# EAGLE design memory_module (EAGLE 9.6.1)
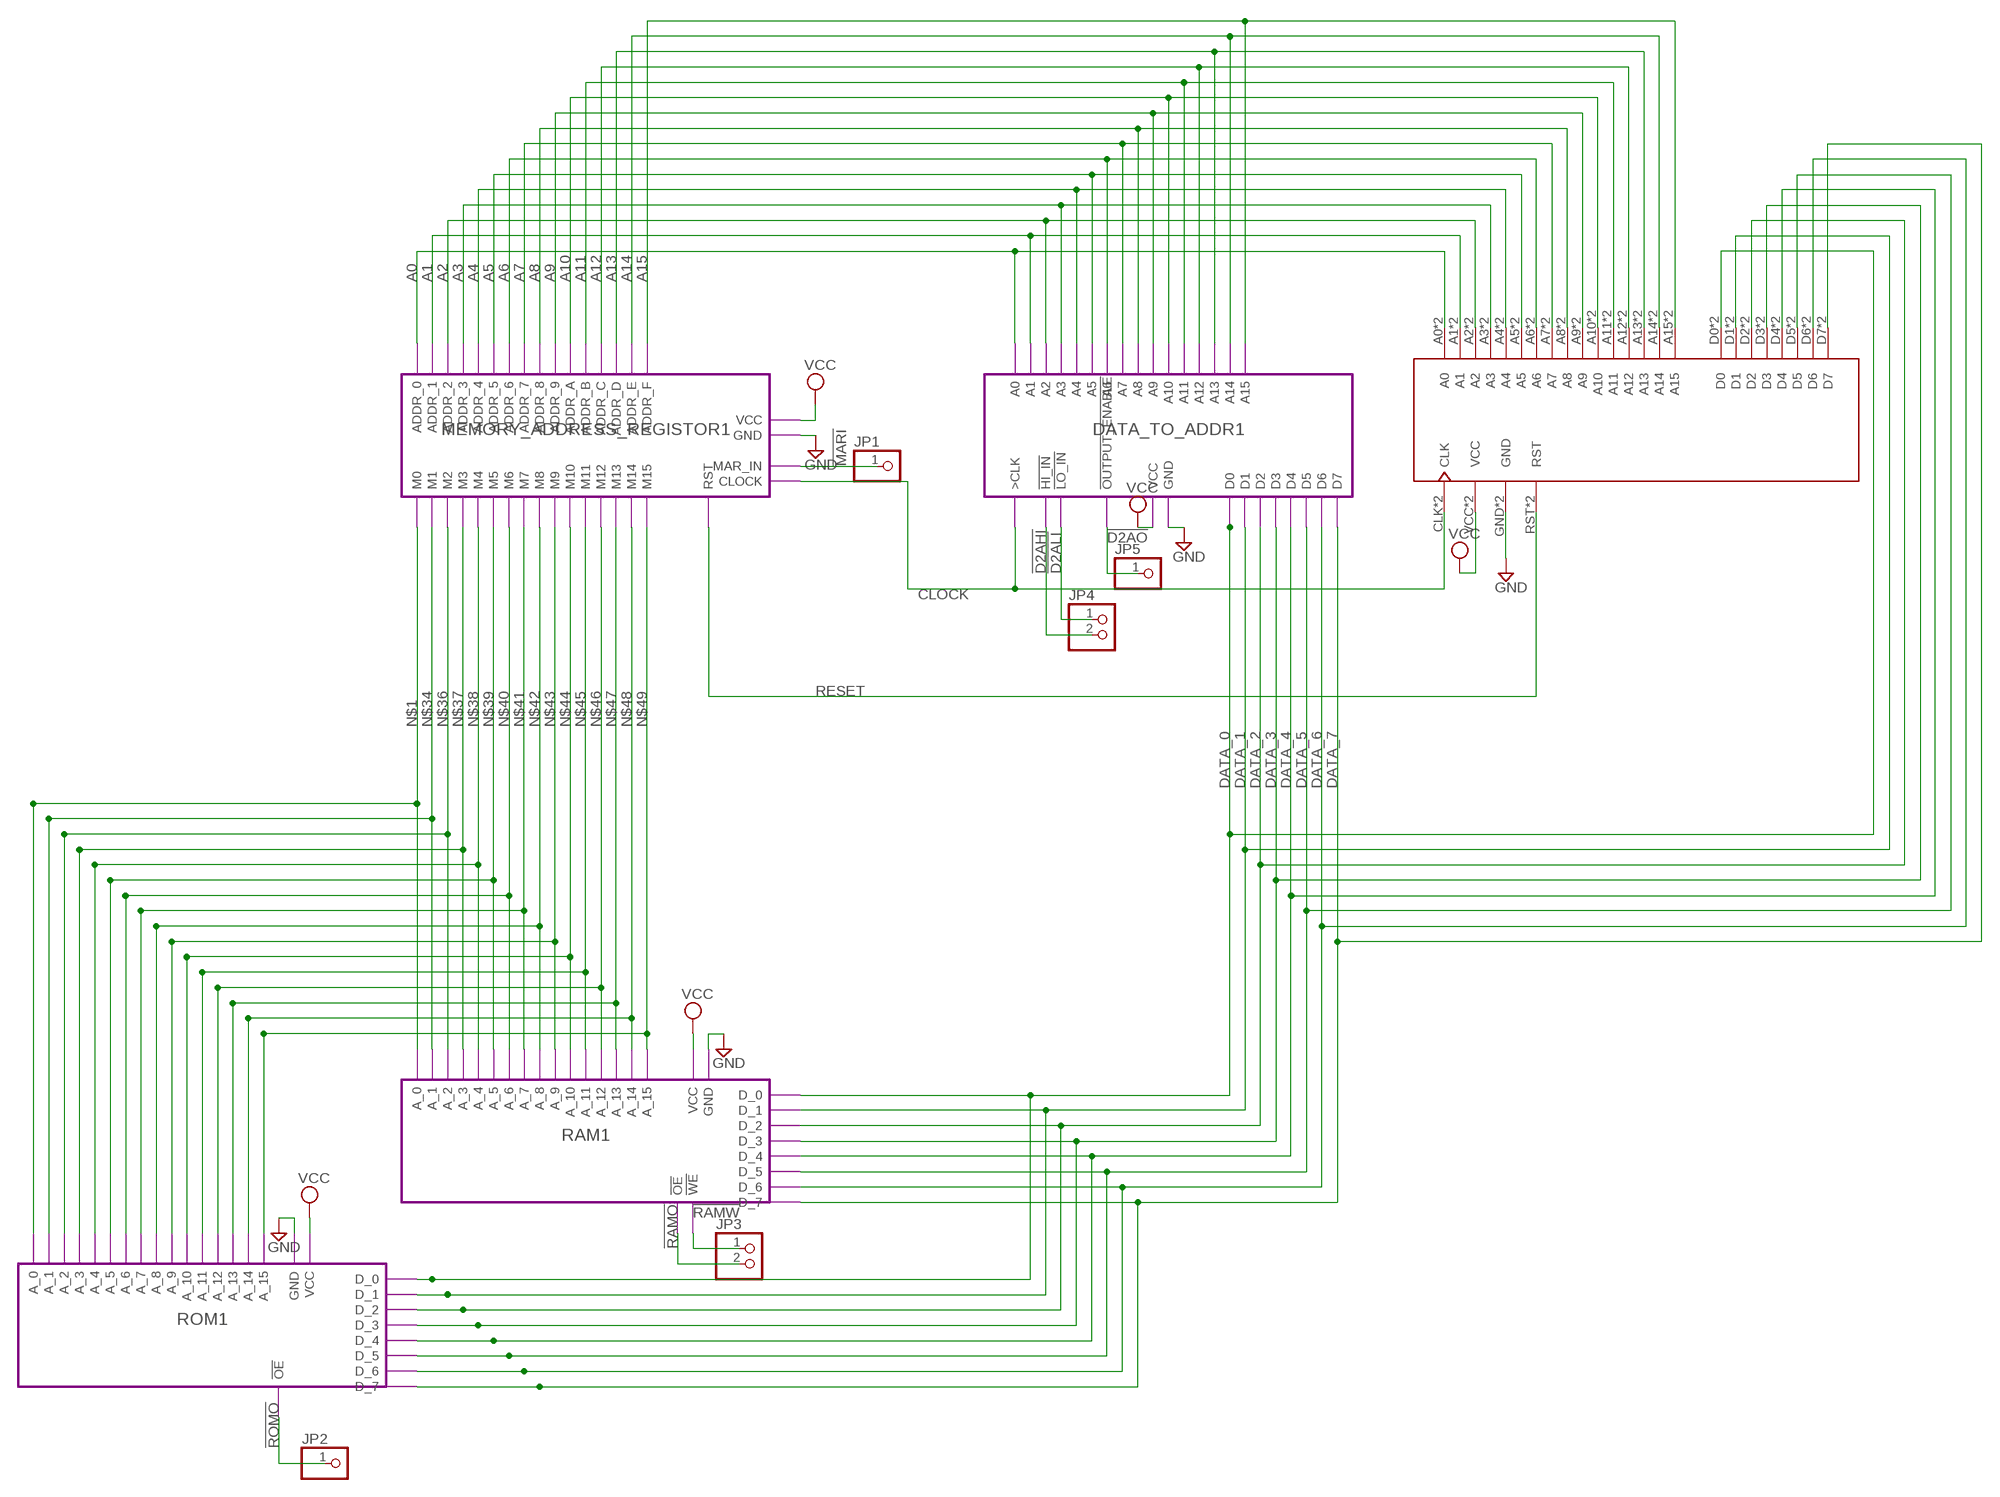
[diagram p0: schematic, sheet 1]

## Parts
JP1  PINHD-1X1  [1X01]
JP2  PINHD-1X1  [1X01]
JP3  PINHD-1X2/90  [1X02/90]
JP4  PINHD-1X2/90  [1X02/90]
JP5  PINHD-1X1  [1X01]
U$1  PORT_BOARD  [PORT_FOOTPT]

## Module instances
MEMORY_ADDRESS_REGISTOR1 = MEMORY_ADDRESS_REGISTOR
RAM1 = RAM
DATA_TO_ADDR1 = DATA_TO_ADDR
ROM1 = ROM

## Nets
!D2AHI: JP4.2 ; port DATA_TO_ADDR1.!HI_IN
!D2ALI: JP4.1 ; port DATA_TO_ADDR1.!LO_IN
!D2AO: JP5.1 ; port DATA_TO_ADDR1.!OUTPUT_ENABLE
!MARI: JP1.1 ; port MEMORY_ADDRESS_REGISTOR1.MAR_IN
!RAMO: JP3.2 ; port RAM1.!OE
!RAMW: JP3.1 ; port RAM1.!WE
!ROMO: JP2.1 ; port ROM1.!OE
A0: U$1.A0 U$1.A16(A0) ; port DATA_TO_ADDR1.A0
A1: U$1.A1 U$1.A17(A1) ; port DATA_TO_ADDR1.A1
A2: U$1.A2 U$1.A18(A2) ; port DATA_TO_ADDR1.A2
A3: U$1.A3 U$1.A19(A3) ; port DATA_TO_ADDR1.A3
A4: U$1.A4 U$1.A20(A4) ; port DATA_TO_ADDR1.A4
A5: U$1.A5 U$1.A21(A5) ; port DATA_TO_ADDR1.A5
A6: U$1.A6 U$1.A22(A6) ; port DATA_TO_ADDR1.A6
A7: U$1.A7 U$1.A23(A7) ; port DATA_TO_ADDR1.A7
A8: U$1.A8 U$1.A24(A8) ; port DATA_TO_ADDR1.A8
A9: U$1.A9 U$1.A25(A9) ; port DATA_TO_ADDR1.A9
A10: U$1.A10 U$1.A26(A10) ; port DATA_TO_ADDR1.A10
A11: U$1.A11 U$1.A27(A11) ; port DATA_TO_ADDR1.A11
A12: U$1.A12 U$1.A28(A12) ; port DATA_TO_ADDR1.A12
A13: U$1.A13 U$1.A29(A13) ; port DATA_TO_ADDR1.A13
A14: U$1.A14 U$1.A30(A14) ; port DATA_TO_ADDR1.A14
A15: U$1.A15 U$1.A31(A15) ; port DATA_TO_ADDR1.A15
CLOCK: U$1.CLK U$1.CLK1(CLK) ; port DATA_TO_ADDR1.>CLK
DATA_0: U$1.D0 U$1.D8(D0) ; port DATA_TO_ADDR1.D0
DATA_1: U$1.D1 U$1.D9(D1) ; port DATA_TO_ADDR1.D1
DATA_2: U$1.D2 U$1.D10(D2) ; port DATA_TO_ADDR1.D2
DATA_3: U$1.D3 U$1.D11(D3) ; port DATA_TO_ADDR1.D3
DATA_4: U$1.D4 U$1.D12(D4) ; port DATA_TO_ADDR1.D4
DATA_5: U$1.D5 U$1.D13(D5) ; port DATA_TO_ADDR1.D5
DATA_6: U$1.D6 U$1.D14(D6) ; port DATA_TO_ADDR1.D6
DATA_7: U$1.D7 U$1.D15(D7) ; port DATA_TO_ADDR1.D7
GND: U$1.GND U$1.GND1(GND) ; port ROM1.GND MEMORY_ADDRESS_REGISTOR1.GND DATA_TO_ADDR1.GND RAM1.GND
RESET: U$1.RST U$1.RST1(RST) ; port MEMORY_ADDRESS_REGISTOR1.RST
VCC: U$1.VCC U$1.VCC1(VCC) ; port ROM1.VCC MEMORY_ADDRESS_REGISTOR1.VCC DATA_TO_ADDR1.VCC RAM1.VCC

## Library data of the parts
JP1 JP2 JP5 = pinhead:PINHD-1X1: PIN HEADER
JP3 JP4 = pinhead:PINHD-1X2: PIN HEADER
U$1 = stack_interface:PORT_BOARD

## Module DATA_REGISTOR
Ports: DATA_0(io) DATA_1(io) DATA_2(io) DATA_3(io) DATA_4(io) DATA_5(io) DATA_6(io) DATA_7(io) !INPUT_ENABLE(in) !OUTPUT_ENABLE(in) CLOCK(in) CLR(in) UB_0(out) UB_1(out) UB_2(out) UB_3(out) UB_4(out) UB_5(out) UB_6(out) UB_7(out) VCC(pwr) GND(pwr)
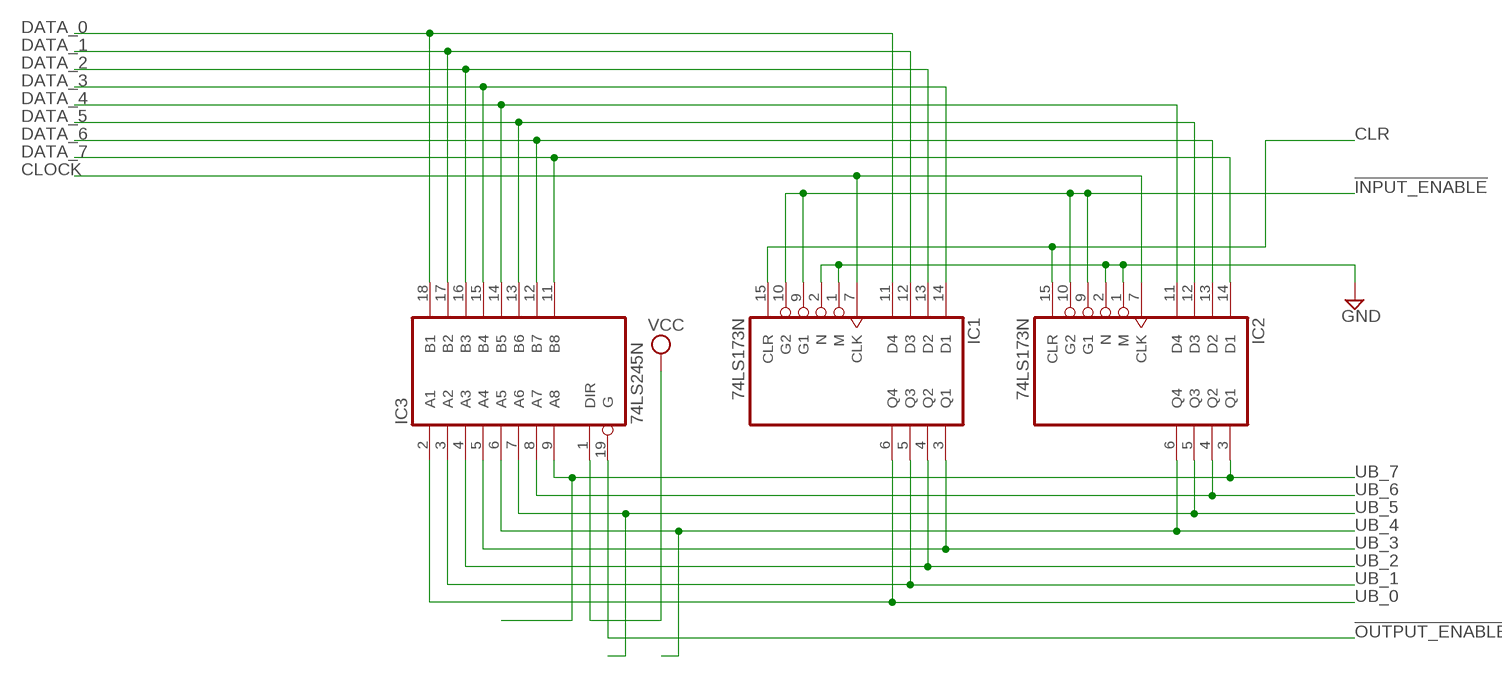
[diagram p1: schematic, module DATA_REGISTOR, sheet 1]

### Parts
IC1  74LS173N  [DIL16]
IC2  74LS173N  [DIL16]
IC3  74LS245N  [DIL20]

### Nets
!INPUT_ENABLE: IC1.9(G1) IC1.10(G2) IC2.9(G1) IC2.10(G2)
!OUTPUT_ENABLE: IC3.19(G)
CLOCK: IC1.7(CLK) IC2.7(CLK)
CLR: IC1.15(CLR) IC2.15(CLR)
DATA_0: IC1.11(D4) IC3.18(B1)
DATA_1: IC1.12(D3) IC3.17(B2)
DATA_2: IC1.13(D2) IC3.16(B3)
DATA_3: IC1.14(D1) IC3.15(B4)
DATA_4: IC2.11(D4) IC3.14(B5)
DATA_5: IC2.12(D3) IC3.13(B6)
DATA_6: IC2.13(D2) IC3.12(B7)
DATA_7: IC2.14(D1) IC3.11(B8)
GND: IC1.1(M) IC1.2(N) IC2.1(M) IC2.2(N)
UB_0: IC1.6(Q4) IC3.2(A1)
UB_1: IC1.5(Q3) IC3.3(A2)
UB_2: IC1.4(Q2) IC3.4(A3)
UB_3: IC1.3(Q1) IC3.5(A4)
UB_4: IC2.6(Q4) IC3.6(A5)
UB_5: IC2.5(Q3) IC3.7(A6)
UB_6: IC2.4(Q2) IC3.8(A7)
UB_7: IC2.3(Q1) IC3.9(A8)
VCC: IC3.1(DIR)

### Power pins joined to a net without a drawn wire
GND: IC1.8(GND) IC2.8(GND) IC3.10(GND)
VCC: IC1.16(VCC) IC2.16(VCC) IC3.20(VCC)

### Library data of the parts
IC1 IC2 = 74xx-eu:74*173: 4-bit D type REGISTER, 3-state
IC3 = 74xx-eu:74*245: Octal BUS TRANSCEIVER, 3-state

## Module MEMORY_ADDRESS_REGISTOR
Ports: ADDR_0(in) ADDR_1(in) ADDR_2(in) ADDR_3(in) ADDR_4(in) ADDR_5(in) ADDR_6(in) ADDR_7(in) ADDR_8(in) ADDR_9(in) ADDR_A(in) ADDR_B(in) ADDR_C(in) ADDR_D(in) ADDR_E(in) ADDR_F(in) CLOCK(in) MAR_IN(in) M0(out) M1(out) M2(out) M3(out) M4(out) M5(out) M6(out) M7(out) M8(out) M9(out) M10(out) M11(out) M12(out) M13(out) M14(out) M15(out) GND(pwr) VCC(pwr) RST(in)
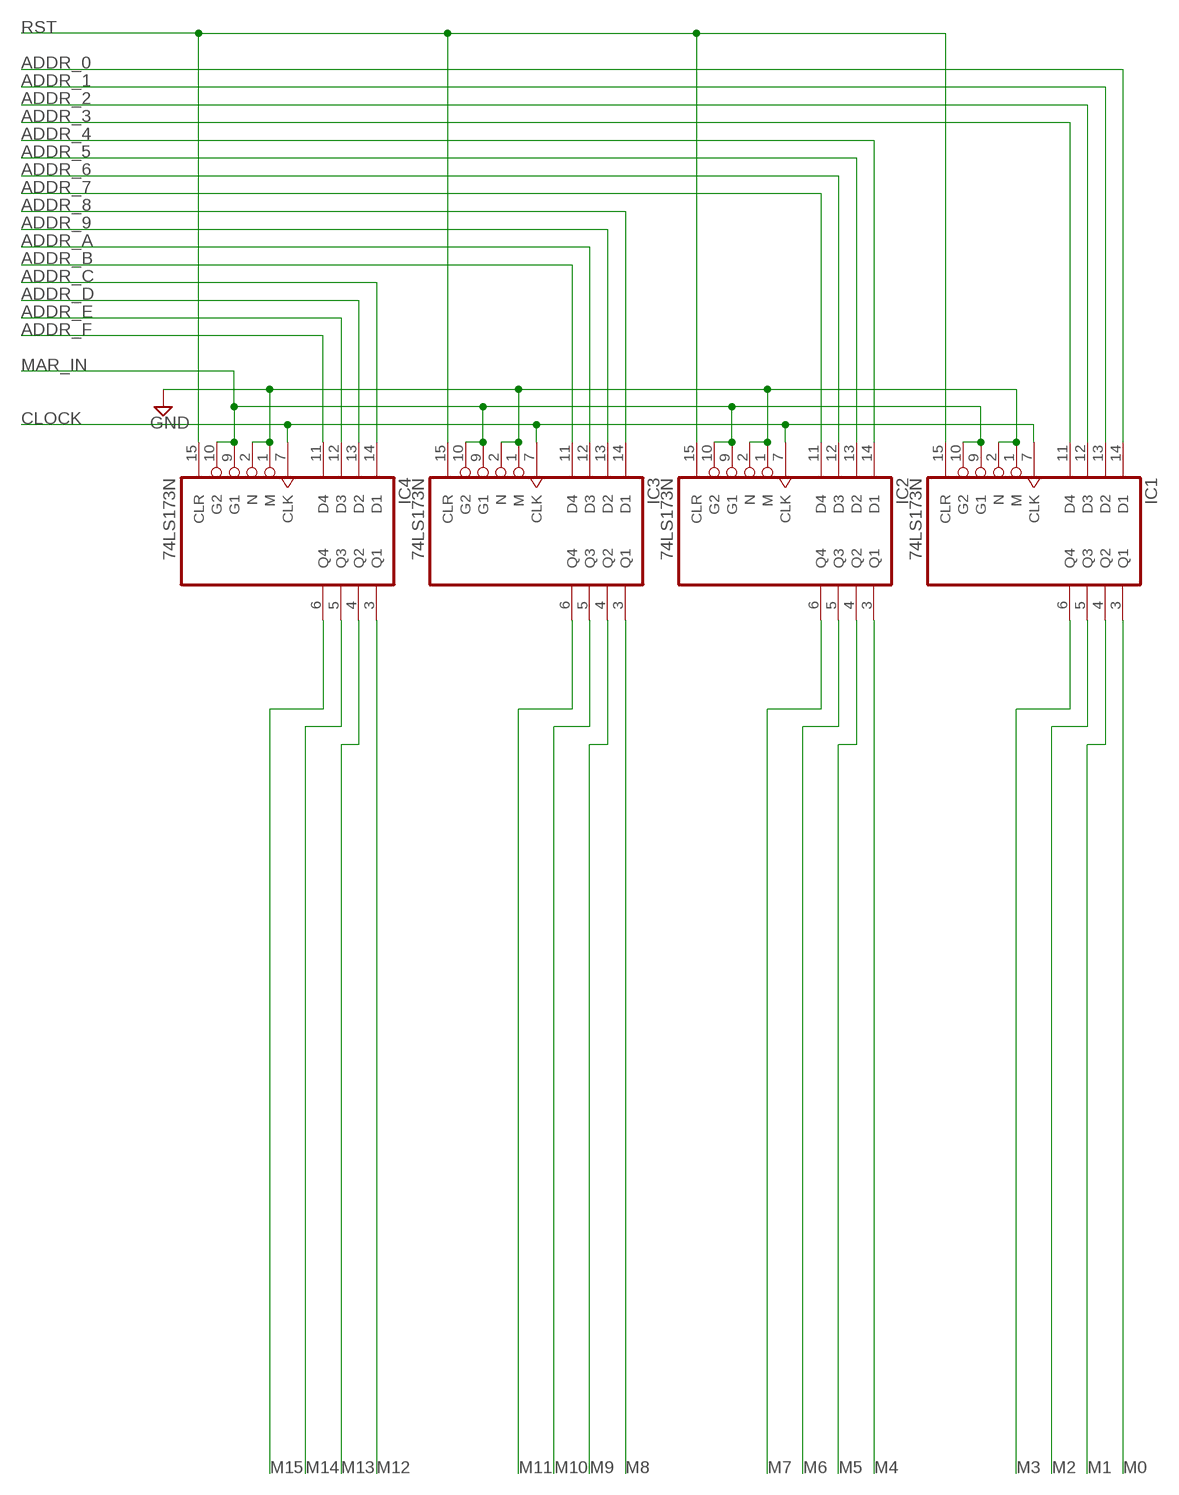
[diagram p2: schematic, module MEMORY_ADDRESS_REGISTOR, sheet 1]

### Parts
IC1  74LS173N  [DIL16]
IC2  74LS173N  [DIL16]
IC3  74LS173N  [DIL16]
IC4  74LS173N  [DIL16]

### Nets
ADDR_0: IC1.14(D1)
ADDR_1: IC1.13(D2)
ADDR_2: IC1.12(D3)
ADDR_3: IC1.11(D4)
ADDR_4: IC2.14(D1)
ADDR_5: IC2.13(D2)
ADDR_6: IC2.12(D3)
ADDR_7: IC2.11(D4)
ADDR_8: IC3.14(D1)
ADDR_9: IC3.13(D2)
ADDR_A: IC3.12(D3)
ADDR_B: IC3.11(D4)
ADDR_C: IC4.14(D1)
ADDR_D: IC4.13(D2)
ADDR_E: IC4.12(D3)
ADDR_F: IC4.11(D4)
CLOCK: IC1.7(CLK) IC2.7(CLK) IC3.7(CLK) IC4.7(CLK)
GND: IC1.1(M) IC1.2(N) IC2.1(M) IC2.2(N) IC3.1(M) IC3.2(N) IC4.1(M) IC4.2(N)
M0: IC1.3(Q1)
M1: IC1.4(Q2)
M2: IC1.5(Q3)
M3: IC1.6(Q4)
M4: IC2.3(Q1)
M5: IC2.4(Q2)
M6: IC2.5(Q3)
M7: IC2.6(Q4)
M8: IC3.3(Q1)
M9: IC3.4(Q2)
M10: IC3.5(Q3)
M11: IC3.6(Q4)
M12: IC4.3(Q1)
M13: IC4.4(Q2)
M14: IC4.5(Q3)
M15: IC4.6(Q4)
MAR_IN: IC1.9(G1) IC1.10(G2) IC2.9(G1) IC2.10(G2) IC3.9(G1) IC3.10(G2) IC4.9(G1) IC4.10(G2)
RST: IC1.15(CLR) IC2.15(CLR) IC3.15(CLR) IC4.15(CLR)

### Power pins joined to a net without a drawn wire
GND: IC1.8(GND) IC2.8(GND) IC3.8(GND) IC4.8(GND)
VCC: IC1.16(VCC) IC2.16(VCC) IC3.16(VCC) IC4.16(VCC)

### Library data of the parts
IC1-IC4 = 74xx-eu:74*173: 4-bit D type REGISTER, 3-state

## Module RAM
Ports: A_0(in) A_1(in) A_2(in) A_3(in) A_4(in) A_5(in) A_6(in) A_7(in) A_8(in) A_9(in) A_10(in) A_11(in) A_12(in) A_13(in) A_14(in) A_15(in) !OE(in) !WE(in) D_0(io) D_1(io) D_2(io) D_3(io) D_4(io) D_5(io) D_6(io) D_7(io) VCC(pwr) GND(pwr)
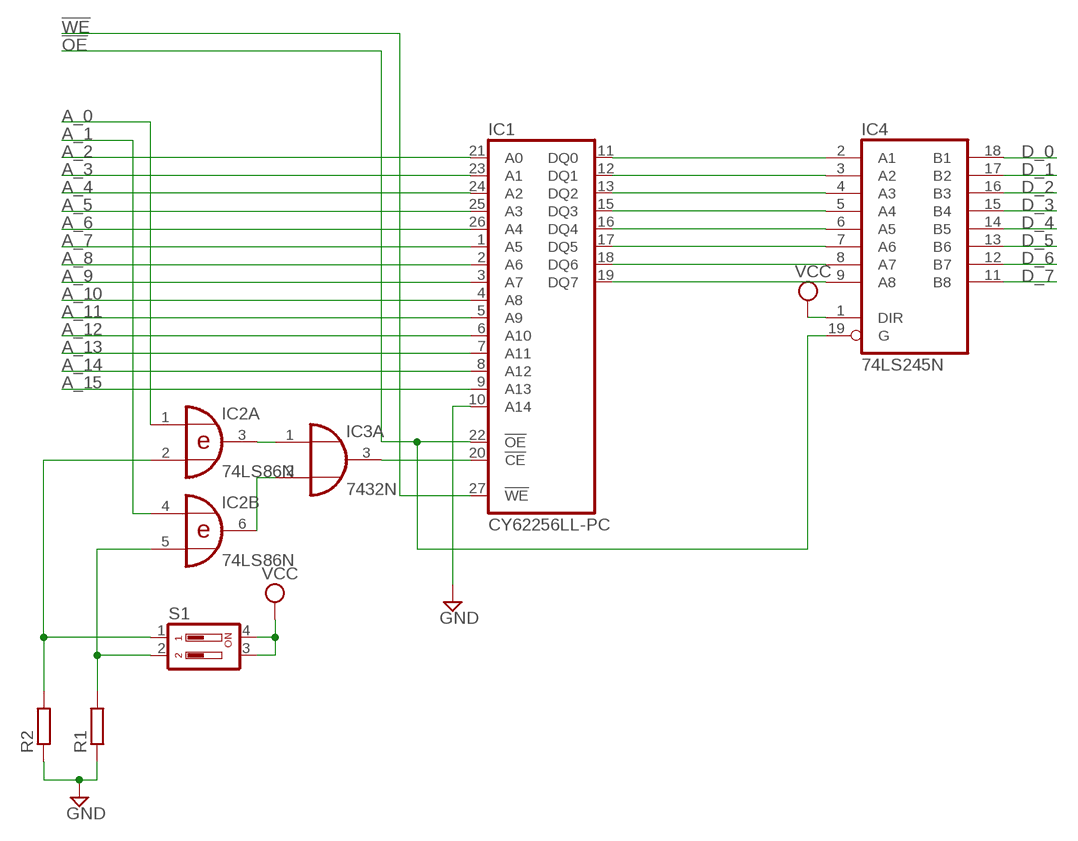
[diagram p3: schematic, module RAM, sheet 1]

### Parts
IC1  CY62256LL-PC  [DIL28-6]
IC2  74LS86N  [DIL14]
IC3  7432N  [DIL14]
IC4  74LS245N  [DIL20]
R1  R-EU_0207/7  [0207/7]
R2  R-EU_0207/7  [0207/7]
S1  DIP02YL  [DIP02YL]

### Nets
!OE: IC1.22(!OE) IC4.19(G)
!WE: IC1.27(!WE)
A_0: IC2.1(A:I0)
A_1: IC2.4(B:I0)
A_2: IC1.21(A0)
A_3: IC1.23(A1)
A_4: IC1.24(A2)
A_5: IC1.25(A3)
A_6: IC1.26(A4)
A_7: IC1.1(A5)
A_8: IC1.2(A6)
A_9: IC1.3(A7)
A_10: IC1.4(A8)
A_11: IC1.5(A9)
A_12: IC1.6(A10)
A_13: IC1.7(A11)
A_14: IC1.8(A12)
A_15: IC1.9(A13)
D_0: IC4.18(B1)
D_1: IC4.17(B2)
D_2: IC4.16(B3)
D_3: IC4.15(B4)
D_4: IC4.14(B5)
D_5: IC4.13(B6)
D_6: IC4.12(B7)
D_7: IC4.11(B8)
GND: IC1.10(A14) R1.1 R2.1
N$1: IC1.11(DQ0) IC4.2(A1)
N$2: IC1.12(DQ1) IC4.3(A2)
N$3: IC1.13(DQ2) IC4.4(A3)
N$4: IC1.15(DQ3) IC4.5(A4)
N$5: IC1.16(DQ4) IC4.6(A5)
N$6: IC1.17(DQ5) IC4.7(A6)
N$7: IC1.18(DQ6) IC4.8(A7)
N$8: IC1.19(DQ7) IC4.9(A8)
N$23: IC2.5(B:I1) R1.2 S1.2
N$24: IC2.2(A:I1) R2.2 S1.1
N$27: IC2.3(A:O) IC3.1(A:I0)
N$28: IC2.6(B:O) IC3.2(A:I1)
N$29: IC1.20(!CE) IC3.3(A:O)
VCC: IC4.1(DIR) S1.3 S1.4
Unconnected: IC2.8(C:O) IC2.9(C:I0) IC2.10(C:I1) IC2.11(D:O) IC2.12(D:I0) IC2.13(D:I1) IC3.4(B:I0) IC3.5(B:I1) IC3.6(B:O) IC3.8(C:O) IC3.9(C:I0) IC3.10(C:I1) IC3.11(D:O) IC3.12(D:I0) IC3.13(D:I1)

### Power pins joined to a net without a drawn wire
GND: IC1.14(GND) IC2.7(P:GND) IC3.7(P:GND) IC4.10(GND)
VCC: IC1.28(VCC) IC2.14(P:VCC) IC3.14(P:VCC) IC4.20(VCC)

### Library data of the parts
IC1 = memory-sram:CY62256LL-?*: 256K (32K x 8) CMOS-Static RAM Source: http://download.cypress.com.edgesuite.net/design_resources/datasheets/contents/cy62256_8.pdf
IC2 = 74xx-eu:74*86: Quad 2-input EXCLUSIVE-OR (XOR) gate
IC3 = 74xx-eu:74*32: Quad 2-input OR gate
IC4 = 74xx-eu:74*245: Octal BUS TRANSCEIVER, 3-state
R1 R2 = resistor:R-EU_: RESISTOR, European symbol
S1 = switch-dil:DIP02YL: DIL/CODE SWITCH; OC_FARNELL: unknown; OC_NEWARK: unknown

## Module DATA_TO_ADDR
Ports: D0(in) D1(in) D2(in) D3(in) D4(in) D5(in) D6(in) D7(in) >CLK(in) !HI_IN(in) !LO_IN(in) !OUTPUT_ENABLE(in) VCC(pwr) GND(pwr) A0(out) A1(out) A2(out) A3(out) A4(out) A5(out) A6(out) A7(out) A8(out) A9(out) A10(out) A11(out) A12(out) A13(out) A14(out) A15(out)
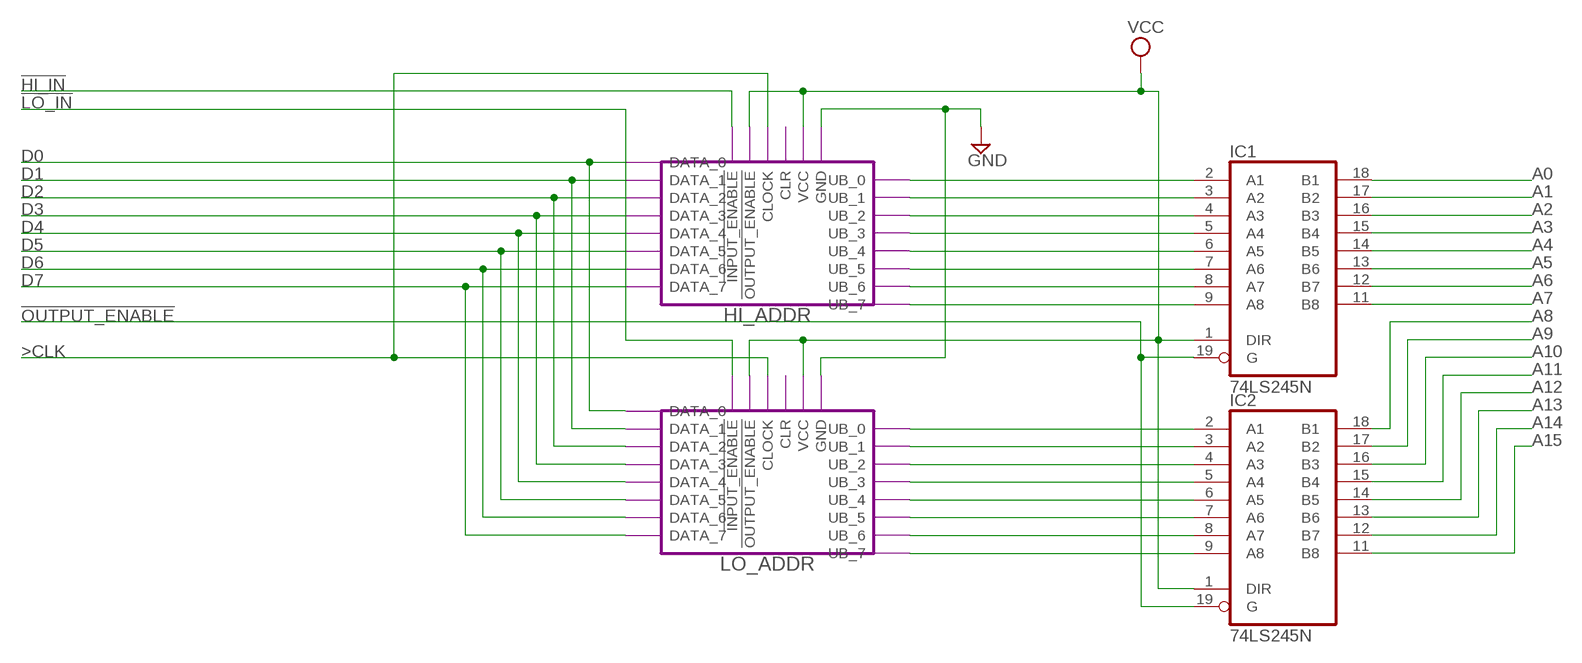
[diagram p4: schematic, module DATA_TO_ADDR, sheet 1]

### Parts
IC1  74LS245N  [DIL20]
IC2  74LS245N  [DIL20]

### Module instances
HI_ADDR = DATA_REGISTOR
LO_ADDR = DATA_REGISTOR

### Nets
!HI_IN: port HI_ADDR.!INPUT_ENABLE
!LO_IN: port LO_ADDR.!INPUT_ENABLE
!OUTPUT_ENABLE: IC1.19(G) IC2.19(G)
>CLK: port LO_ADDR.CLOCK HI_ADDR.CLOCK
A0: IC1.18(B1)
A1: IC1.17(B2)
A2: IC1.16(B3)
A3: IC1.15(B4)
A4: IC1.14(B5)
A5: IC1.13(B6)
A6: IC1.12(B7)
A7: IC1.11(B8)
A8: IC2.18(B1)
A9: IC2.17(B2)
A10: IC2.16(B3)
A11: IC2.15(B4)
A12: IC2.14(B5)
A13: IC2.13(B6)
A14: IC2.12(B7)
A15: IC2.11(B8)
D0: port HI_ADDR.DATA_0 LO_ADDR.DATA_0
D1: port HI_ADDR.DATA_1 LO_ADDR.DATA_1
D2: port HI_ADDR.DATA_2 LO_ADDR.DATA_2
D3: port HI_ADDR.DATA_3 LO_ADDR.DATA_3
D4: port HI_ADDR.DATA_4 LO_ADDR.DATA_4
D5: port HI_ADDR.DATA_5 LO_ADDR.DATA_5
D6: port HI_ADDR.DATA_6 LO_ADDR.DATA_6
D7: port HI_ADDR.DATA_7 LO_ADDR.DATA_7
GND: port LO_ADDR.GND HI_ADDR.GND
N$16: IC1.2(A1) ; port HI_ADDR.UB_0
N$17: IC1.3(A2) ; port HI_ADDR.UB_1
N$18: IC1.4(A3) ; port HI_ADDR.UB_2
N$19: IC1.5(A4) ; port HI_ADDR.UB_3
N$20: IC1.6(A5) ; port HI_ADDR.UB_4
N$21: IC1.7(A6) ; port HI_ADDR.UB_5
N$22: IC1.8(A7) ; port HI_ADDR.UB_6
N$23: IC1.9(A8) ; port HI_ADDR.UB_7
N$24: IC2.2(A1) ; port LO_ADDR.UB_0
N$25: IC2.3(A2) ; port LO_ADDR.UB_1
N$26: IC2.4(A3) ; port LO_ADDR.UB_2
N$27: IC2.5(A4) ; port LO_ADDR.UB_3
N$28: IC2.6(A5) ; port LO_ADDR.UB_4
N$29: IC2.7(A6) ; port LO_ADDR.UB_5
N$30: IC2.8(A7) ; port LO_ADDR.UB_6
N$31: IC2.9(A8) ; port LO_ADDR.UB_7
VCC: IC1.1(DIR) IC2.1(DIR) ; port HI_ADDR.VCC HI_ADDR.!OUTPUT_ENABLE LO_ADDR.!OUTPUT_ENABLE LO_ADDR.VCC

### Power pins joined to a net without a drawn wire
GND: IC1.10(GND) IC2.10(GND)
VCC: IC1.20(VCC) IC2.20(VCC)

### Library data of the parts
IC1 IC2 = 74xx-eu:74*245: Octal BUS TRANSCEIVER, 3-state

## Module ROM
Ports: A_0(in) A_1(in) A_2(in) A_3(in) A_4(in) A_5(in) A_6(in) A_7(in) A_8(in) A_9(in) A_10(in) A_11(in) A_12(in) A_13(in) A_14(in) A_15(in) !OE(in) D_0(out) D_1(out) D_2(out) D_4(out) D_3(out) D_5(out) D_6(out) D_7(out) GND(pwr) VCC(pwr)
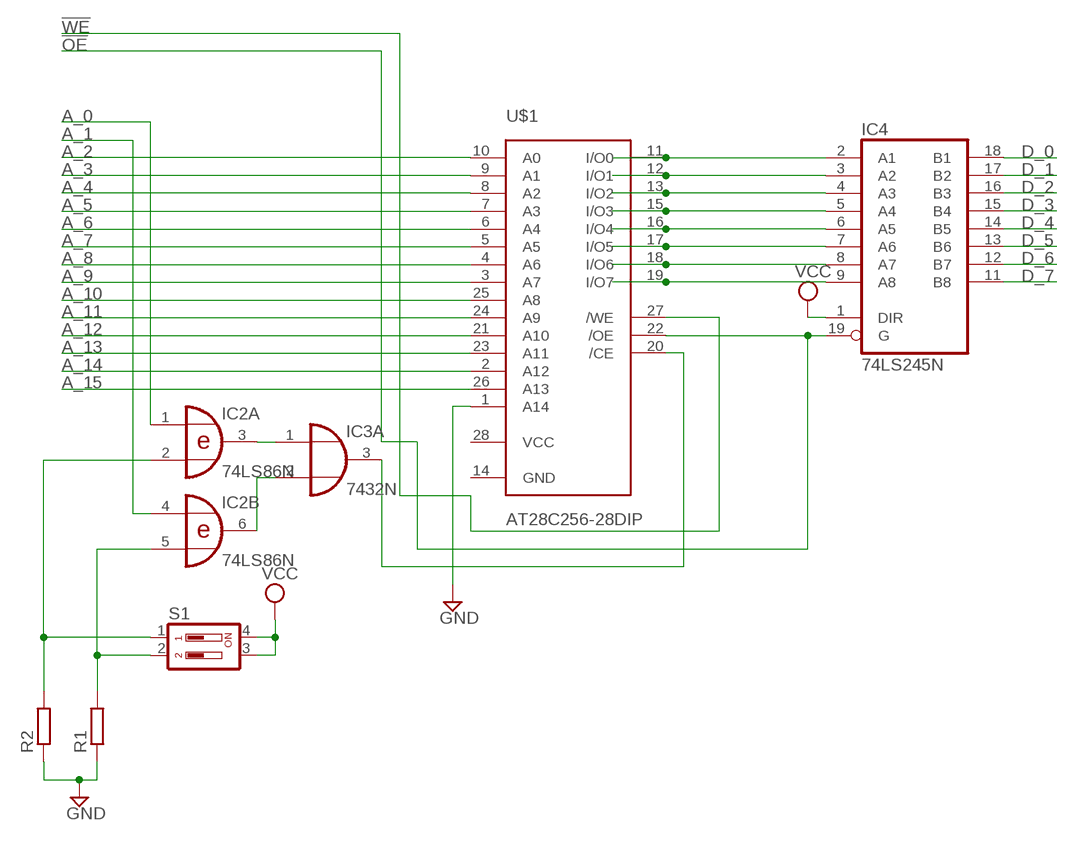
[diagram p5: schematic, module ROM, sheet 1]

### Parts
IC2  74LS86N  [DIL14]
IC3  7432N  [DIL14]
IC4  74LS245N  [DIL20]
R1  R-EU_0207/7  [0207/7]
R2  R-EU_0207/7  [0207/7]
S1  DIP02YL  [DIP02YL]
U$1  AT28C256-28DIP  [DIL28-6]

### Nets
!OE: IC4.19(G) U$1.22(/OE)
!WE: U$1.27(/WE)
A_0: IC2.1(A:I0)
A_1: IC2.4(B:I0)
A_2: U$1.10(A0)
A_3: U$1.9(A1)
A_4: U$1.8(A2)
A_5: U$1.7(A3)
A_6: U$1.6(A4)
A_7: U$1.5(A5)
A_8: U$1.4(A6)
A_9: U$1.3(A7)
A_10: U$1.25(A8)
A_11: U$1.24(A9)
A_12: U$1.21(A10)
A_13: U$1.23(A11)
A_14: U$1.2(A12)
A_15: U$1.26(A13)
D_0: IC4.18(B1)
D_1: IC4.17(B2)
D_2: IC4.16(B3)
D_3: IC4.15(B4)
D_4: IC4.14(B5)
D_5: IC4.13(B6)
D_6: IC4.12(B7)
D_7: IC4.11(B8)
GND: R1.1 R2.1 U$1.1(A14)
N$1: IC4.2(A1) U$1.11(I/O0)
N$2: IC4.3(A2) U$1.12(I/O1)
N$3: IC4.4(A3) U$1.13(I/O2)
N$4: IC4.5(A4) U$1.15(I/O3)
N$5: IC4.6(A5) U$1.16(I/O4)
N$6: IC4.7(A6) U$1.17(I/O5)
N$7: IC4.8(A7) U$1.18(I/O6)
N$8: IC4.9(A8) U$1.19(I/O7)
N$23: IC2.5(B:I1) R1.2 S1.2
N$24: IC2.2(A:I1) R2.2 S1.1
N$27: IC2.3(A:O) IC3.1(A:I0)
N$28: IC2.6(B:O) IC3.2(A:I1)
N$29: IC3.3(A:O) U$1.20(/CE)
VCC: IC4.1(DIR) S1.3 S1.4
Unconnected: IC2.8(C:O) IC2.9(C:I0) IC2.10(C:I1) IC2.11(D:O) IC2.12(D:I0) IC2.13(D:I1) IC3.4(B:I0) IC3.5(B:I1) IC3.6(B:O) IC3.8(C:O) IC3.9(C:I0) IC3.10(C:I1) IC3.11(D:O) IC3.12(D:I0) IC3.13(D:I1) U$1.14(GND) U$1.28(VCC)

### Power pins joined to a net without a drawn wire
GND: IC2.7(P:GND) IC3.7(P:GND) IC4.10(GND)
VCC: IC2.14(P:VCC) IC3.14(P:VCC) IC4.20(VCC)

### Library data of the parts
IC2 = 74xx-eu:74*86: Quad 2-input EXCLUSIVE-OR (XOR) gate
IC3 = 74xx-eu:74*32: Quad 2-input OR gate
IC4 = 74xx-eu:74*245: Octal BUS TRANSCEIVER, 3-state
R1 R2 = resistor:R-EU_: RESISTOR, European symbol
S1 = switch-dil:DIP02YL: DIL/CODE SWITCH; OC_FARNELL: unknown; OC_NEWARK: unknown
U$1 = atmel-custom:AT28C256-28DIP: IC EEPROM 256KBIT 150NS 28DIP

## Board
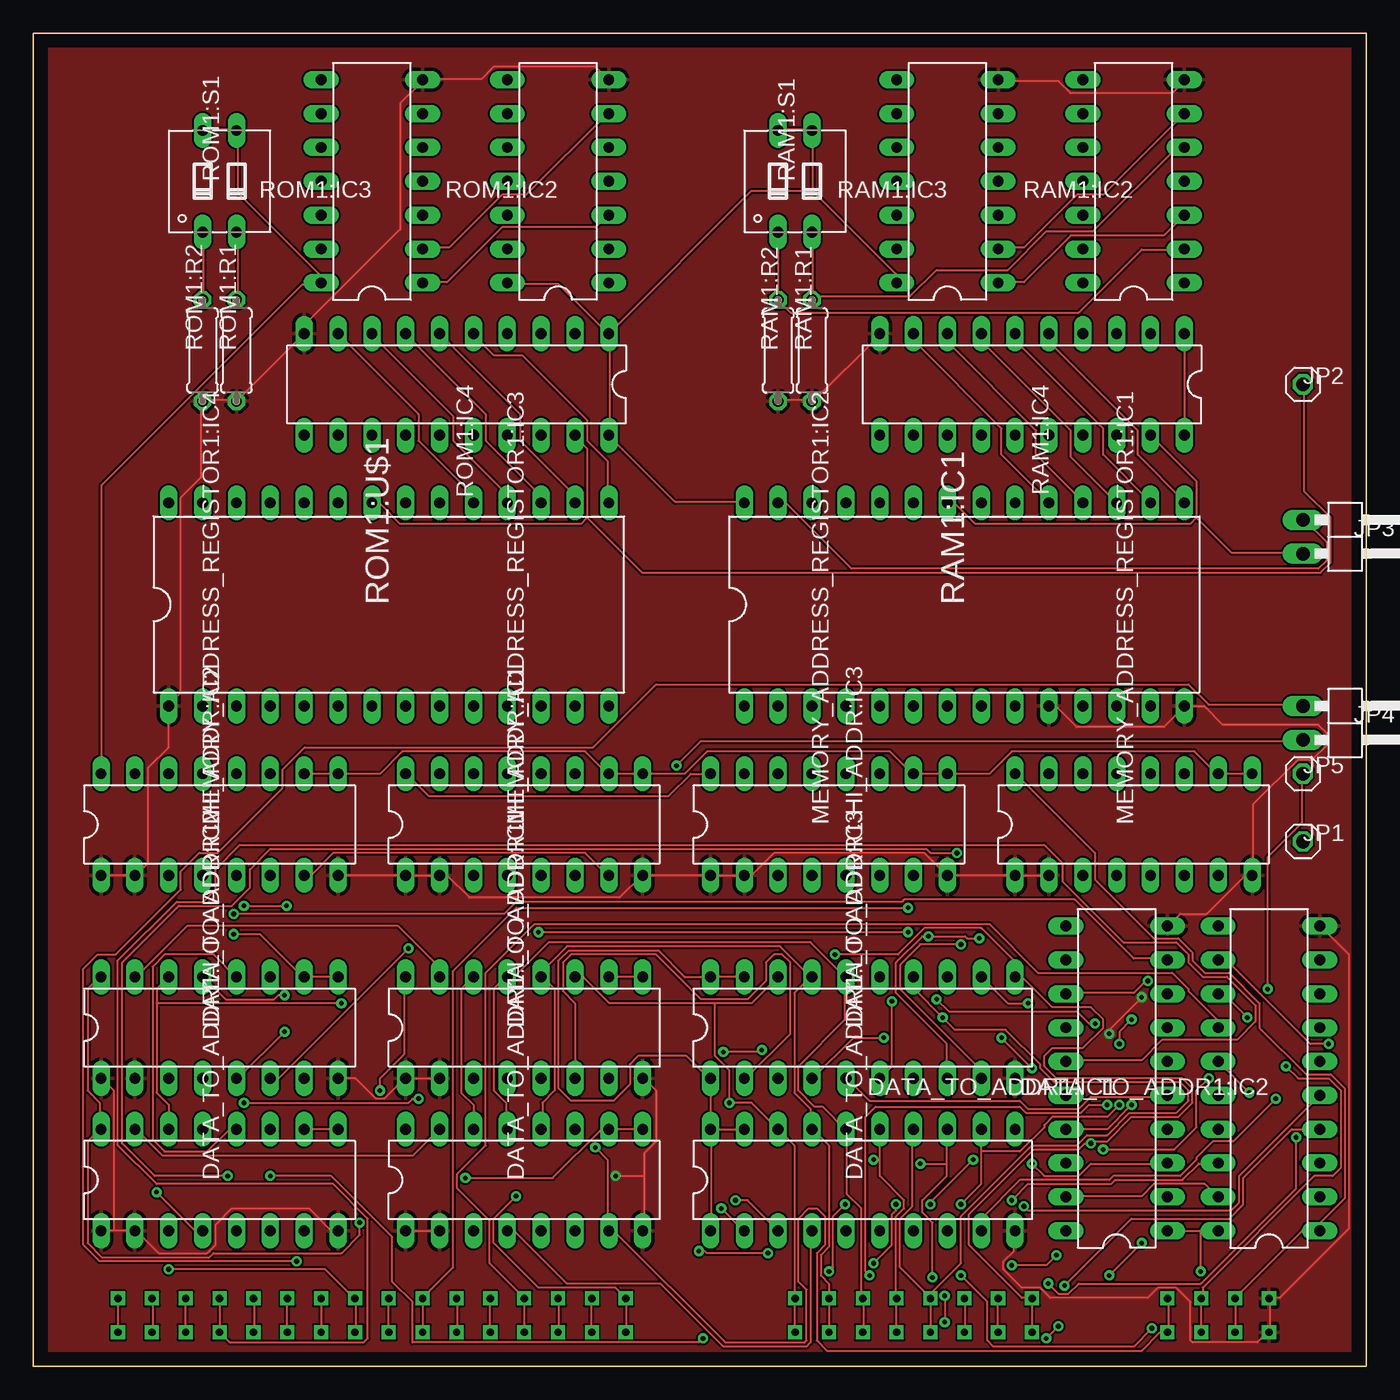
[diagram p6: board, top side]
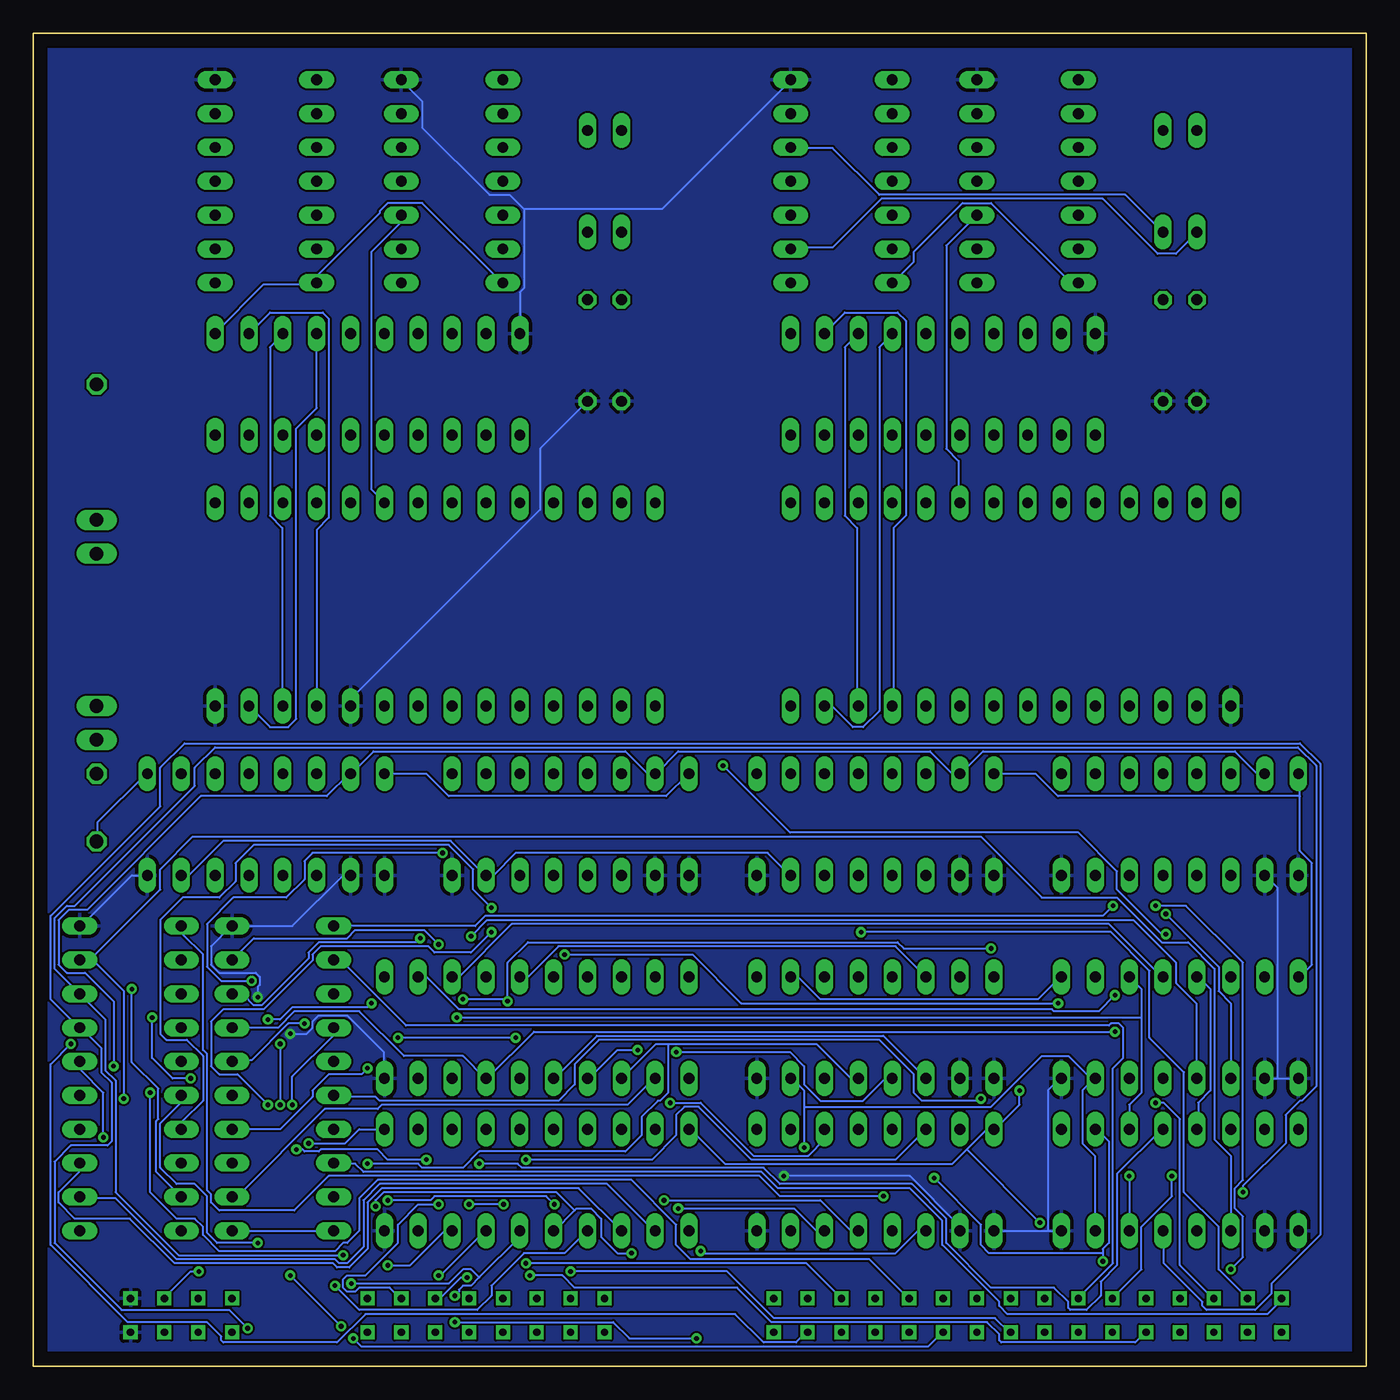
[diagram p7: board, bottom side, seen from below]

Size 100 x 100 mm. Coordinates in mm from the lower left corner, seen from the top.
Copper layers (1*16): Top 0.035mm / dielectric 1.5mm / Bottom 0.035mm
Design rules "default": minimum track width 6mil, minimum drill 0.35mm, track to track 6mil, track to pad 6mil, pad to pad 6mil, via to via 6mil, smd to smd 6mil, copper to edge 40mil, drill to drill 6mil, minimum pad ring 10mil, minimum via ring 8mil, stop-mask expansion 4mil, vias tented up to drill 0mil, thermal gap 10mil

### Footprints (pad centres in the part's own frame; a part is rotated, then mirrored left to right if it is on the bottom)
DIL16 = drill 0.813 long: 1 -8.89,-3.81; 2 -6.35,-3.81; 3 -3.81,-3.81; 4 -1.27,-3.81; 5 1.27,-3.81; 6 3.81,-3.81; 7 6.35,-3.81; 8 8.89,-3.81; 9 8.89,3.81; 10 6.35,3.81; 11 3.81,3.81; 12 1.27,3.81; 13 -1.27,3.81; 14 -3.81,3.81; 15 -6.35,3.81; 16 -8.89,3.81
DIL20 = drill 0.813 long: 1 -11.43,-3.81; 2 -8.89,-3.81; 3 -6.35,-3.81; 4 -3.81,-3.81; 5 -1.27,-3.81; 6 1.27,-3.81; 7 3.81,-3.81; 8 6.35,-3.81; 9 8.89,-3.81; 10 11.43,-3.81; 11 11.43,3.81; 12 8.89,3.81; 13 6.35,3.81; 14 3.81,3.81; 15 1.27,3.81; 16 -1.27,3.81; 17 -3.81,3.81; 18 -6.35,3.81; 19 -8.89,3.81; 20 -11.43,3.81
1X01 = drill 1.016 octagon: 1 0,0
1X02/90 = drill 1.016 long: 1 -1.27,-3.81; 2 1.27,-3.81
DIL28-6 = drill 0.813 long: 1 -16.51,-7.62; 2 -13.97,-7.62; 3 -11.43,-7.62; 4 -8.89,-7.62; 5 -6.35,-7.62; 6 -3.81,-7.62; 7 -1.27,-7.62; 8 1.27,-7.62; 9 3.81,-7.62; 10 6.35,-7.62; 11 8.89,-7.62; 12 11.43,-7.62; 13 13.97,-7.62; 14 16.51,-7.62; 15 16.51,7.62; 16 13.97,7.62; 17 11.43,7.62; 18 8.89,7.62; 19 6.35,7.62; 20 3.81,7.62; 21 1.27,7.62; 22 -1.27,7.62; 23 -3.81,7.62; 24 -6.35,7.62; 25 -8.89,7.62; 26 -11.43,7.62; 27 -13.97,7.62; 28 -16.51,7.62
DIL14 = drill 0.813 long: 1 -7.62,-3.81; 2 -5.08,-3.81; 3 -2.54,-3.81; 4 0,-3.81; 5 2.54,-3.81; 6 5.08,-3.81; 7 7.62,-3.81; 8 7.62,3.81; 9 5.08,3.81; 10 2.54,3.81; 11 0,3.81; 12 -2.54,3.81; 13 -5.08,3.81; 14 -7.62,3.81
0207/7 = drill 0.813 octagon: 1 -3.81,0; 2 3.81,0
DIP02YL = drill 0.813 long: 1 -1.27,-3.81; 2 1.27,-3.81; 3 1.27,3.81; 4 -1.27,3.81
PORT_FOOTPT = drill 0.55 square: A0 6.35,2.54; A1 8.89,2.54; A2 11.43,2.54; A3 13.97,2.54; A4 16.51,2.54; A5 19.05,2.54; A6 21.59,2.54; A7 24.13,2.54; A8 26.67,2.54; A9 29.21,2.54; A10 31.75,2.54; A11 34.29,2.54; A12 36.83,2.54; A13 39.37,2.54; A14 41.91,2.54; A15 44.45,2.54; A16 6.35,5.08; A17 8.89,5.08; A18 11.43,5.08; A19 13.97,5.08; A20 16.51,5.08; A21 19.05,5.08; A22 21.59,5.08; A23 24.13,5.08; A24 26.67,5.08; A25 29.21,5.08; A26 31.75,5.08; A27 34.29,5.08; A28 36.83,5.08; A29 39.37,5.08; A30 41.91,5.08; A31 44.45,5.08; CLK 85.09,2.54; CLK1 85.09,5.08; D0 57.15,2.54; D1 59.69,2.54; D2 62.23,2.54; D3 64.77,2.54; D4 67.31,2.54; D5 69.85,2.54; D6 72.39,2.54; D7 74.93,2.54; D8 57.15,5.08; D9 59.69,5.08; D10 62.23,5.08; D11 64.77,5.08; D12 67.31,5.08; D13 69.85,5.08; D14 72.39,5.08; D15 74.93,5.08; GND 92.71,2.54; GND1 92.71,5.08; RST 87.63,2.54; RST1 87.63,5.08; VCC 90.17,2.54; VCC1 90.17,5.08

### Placement (x,y rotation side)
DATA_TO_ADDR1:HI_ADDR:IC1  74LS173N  [DIL16]  36.83,25.4 0 top
DATA_TO_ADDR1:HI_ADDR:IC2  74LS173N  [DIL16]  13.97,25.4 0 top
DATA_TO_ADDR1:HI_ADDR:IC3  74LS245N  [DIL20]  62.23,25.4 0 top
DATA_TO_ADDR1:IC1  74LS245N  [DIL20]  81.28,21.59 90 top
DATA_TO_ADDR1:IC2  74LS245N  [DIL20]  92.71,21.59 90 top
DATA_TO_ADDR1:LO_ADDR:IC1  74LS173N  [DIL16]  36.83,13.97 0 top
DATA_TO_ADDR1:LO_ADDR:IC2  74LS173N  [DIL16]  13.97,13.97 0 top
DATA_TO_ADDR1:LO_ADDR:IC3  74LS245N  [DIL20]  62.23,13.97 0 top
JP1  95.25,39.37 0 top
JP2  95.25,73.66 0 top
JP3  99.06,62.23 270 top
JP4  99.06,48.26 270 top
JP5  95.25,44.45 0 top
MEMORY_ADDRESS_REGISTOR1:IC1  74LS173N  [DIL16]  82.55,40.64 0 top
MEMORY_ADDRESS_REGISTOR1:IC2  74LS173N  [DIL16]  59.69,40.64 0 top
MEMORY_ADDRESS_REGISTOR1:IC3  74LS173N  [DIL16]  36.83,40.64 0 top
MEMORY_ADDRESS_REGISTOR1:IC4  74LS173N  [DIL16]  13.97,40.64 0 top
RAM1:IC1  CY62256LL-PC  [DIL28-6]  69.85,57.15 0 top
RAM1:IC2  74LS86N  [DIL14]  82.55,88.9 90 top
RAM1:IC3  7432N  [DIL14]  68.58,88.9 90 top
RAM1:IC4  74LS245N  [DIL20]  74.93,73.66 180 top
RAM1:R1  [0207/7]  58.42,76.2 90 top
RAM1:R2  [0207/7]  55.88,76.2 90 top
RAM1:S1  [DIP02YL]  57.15,88.9 0 top
ROM1:IC2  74LS86N  [DIL14]  39.37,88.9 90 top
ROM1:IC3  7432N  [DIL14]  25.4,88.9 90 top
ROM1:IC4  74LS245N  [DIL20]  31.75,73.66 180 top
ROM1:R1  [0207/7]  15.24,76.2 90 top
ROM1:R2  [0207/7]  12.7,76.2 90 top
ROM1:S1  [DIP02YL]  13.97,88.9 0 top
ROM1:U$1  AT28C256-28DIP  [DIL28-6]  26.67,57.15 0 top
U$1  0,0 0 top

### Tracks (layer width: path | path; a pad name or v marks a point on that pad's centre or on a via)
!D2AHI  (via drill 0.35)
  Top 0.152: DATA_TO_ADDR1:HI_ADDR:IC1.9 DATA_TO_ADDR1:HI_ADDR:IC1.10 | DATA_TO_ADDR1:HI_ADDR:IC2.9 DATA_TO_ADDR1:HI_ADDR:IC2.10 20.22,29.21 17.02,32.41 v15.04,32.41 | v48.26,45.06 50.09,46.89 95.2,46.89 JP4.2
  Bottom 0.152: v48.26,45.06 43.23,40.03 21.59,40.03 18.69,37.13 18.69,35.76 15.34,32.41 v15.04,32.41 | DATA_TO_ADDR1:HI_ADDR:IC1.10 42.62,29.21 40.95,27.53 24.64,27.53 22.96,29.21 DATA_TO_ADDR1:HI_ADDR:IC2.9
!D2ALI  (via drill 0.35)
  Top 0.152: DATA_TO_ADDR1:LO_ADDR:IC1.9 DATA_TO_ADDR1:LO_ADDR:IC1.10 42.62,17.78 38.96,14.12 v32.41,14.12 | DATA_TO_ADDR1:LO_ADDR:IC2.9 DATA_TO_ADDR1:LO_ADDR:IC2.10 | v19.76,7.87 4.98,7.87 3.76,9.09 3.76,29.82 4.83,30.89 6.2,30.89 11.07,35.76 11.07,37.13 12.45,38.51 13.82,38.51 18.69,43.38 18.69,44.75 20.37,46.43 42.01,46.43 46.74,51.16 86.67,51.16 88.19,49.63 95.2,49.63 JP4.1
  Bottom 0.152: 19.76,8.48 19.76,8.79 19.3,9.25 19.3,16.87 20.22,17.78 DATA_TO_ADDR1:LO_ADDR:IC2.10 | 19.76,8.48 v19.76,7.87 | v32.41,14.12 28.91,10.62 28.91,9.09 28.3,8.48 19.76,8.48
!D2AO  (via drill 0.35)
  Top 0.152: DATA_TO_ADDR1:IC1.19 77.52,12.75 83.16,12.75 84.07,13.67 87.88,13.67 88.8,12.75 DATA_TO_ADDR1:IC2.19 | v92.61,28.3 92.61,38.2 95.2,40.79 95.2,44.45 JP5.1
  Bottom 0.152: v92.61,28.3 92.61,22.81 90.63,20.83 90.63,18.54 90.78,18.39 90.78,14.58 DATA_TO_ADDR1:IC2.19
!MARI
  Top 0.152: MEMORY_ADDRESS_REGISTOR1:IC4.10 MEMORY_ADDRESS_REGISTOR1:IC4.9 26.01,44.45 27.69,46.13 41.4,46.13 43.08,44.45 MEMORY_ADDRESS_REGISTOR1:IC3.10 MEMORY_ADDRESS_REGISTOR1:IC3.9 48.87,44.45 50.55,46.13 64.26,46.13 65.94,44.45 MEMORY_ADDRESS_REGISTOR1:IC2.10 MEMORY_ADDRESS_REGISTOR1:IC2.9 71.73,44.45 73.41,46.13 87.12,46.13 88.8,44.45 MEMORY_ADDRESS_REGISTOR1:IC1.10 MEMORY_ADDRESS_REGISTOR1:IC1.9
  Bottom 0.152: JP1.1 95.2,39.42 95.2,40.79 91.54,44.45 MEMORY_ADDRESS_REGISTOR1:IC1.9
!RAMO
  Top 0.152: 87.27,63.65 86.82,63.2 70.66,63.2 69.14,64.72 68.68,64.72 RAM1:IC1.22 | 87.27,63.65 87.27,66.4 RAM1:IC4.19 | 87.27,63.65 89.87,61.06 95.2,61.06 JP3.2
!RAMW
  Top 0.152: RAM1:IC1.27 55.88,64.72 56.49,64.72 61.37,59.84 96.42,59.84 97.03,60.45 97.03,61.82 95.35,63.5 JP3.1
!ROMO
  Top 0.152: 41.55,63.65 41.1,63.2 27.53,63.2 26.01,64.72 25.4,64.72 ROM1:U$1.22 | 41.55,63.65 41.55,68.83 40.64,69.75 ROM1:IC4.19 | 41.55,63.65 45.67,59.54 96.57,59.54 97.33,60.3 97.33,63.65 95.35,65.63 95.35,73.56 JP2.1
A0
  Top 0.152: U$1.A16 U$1.A0
  Bottom 0.152: DATA_TO_ADDR1:IC1.18 77.37,15.19 75.84,15.19 75.23,14.58 45.36,14.58 44.14,13.36 34.24,13.36 31.8,10.92 31.8,9.09 27.53,4.83 27.53,4.52 26.92,3.91 7.42,3.91 6.35,4.98 U$1.A16
A1  (via drill 0.35)
  Top 0.152: U$1.A1 8.94,2.54 8.94,4.98 U$1.A17 | DATA_TO_ADDR1:IC1.17 80.57,17.78 v82.4,19.61 | v37.9,32.56 v65.63,32.56
  Bottom 0.152: v82.4,19.61 84.68,21.89 86.06,21.89 86.67,22.5 86.67,25.86 85.75,26.77 82.7,26.77 79.05,30.43 79.05,30.89 78.44,31.5 70.36,31.5 69.9,31.04 67.16,31.04 v65.63,32.56 | v37.9,32.56 19.15,32.56 16.26,29.67 16.26,24.64 13.67,22.05 13.67,13.06 11.07,10.46 11.07,7.26 U$1.A17
A2  (via drill 0.35)
  Top 0.152: U$1.A2 11.38,2.54 11.38,4.98 U$1.A18 | v28.91,20.07 28.45,20.07 28.14,19.76 v15.8,19.76
  Bottom 0.152: v28.91,20.07 29.06,19.91 33.33,19.91 33.93,20.52 33.93,21.89 36.53,24.49 57.56,24.49 59.38,22.66 59.38,21.13 60.6,19.91 74.02,19.91 74.32,20.22 77.37,20.22 DATA_TO_ADDR1:IC1.16 | v15.8,19.76 15.19,19.76 13.97,18.54 13.97,7.57 11.53,5.13 U$1.A18
A3
  Top 0.152: U$1.A19 U$1.A3 14.73,1.78 24.79,1.78 25.09,2.08 25.09,11.07 22.5,13.67 9.25,13.67 6.35,16.56 6.35,30.43 10.77,34.85 12.75,34.85 13.67,35.76 13.67,37.29 15.49,39.12 75.84,39.12 77.22,37.74 77.22,36.37 81.79,31.8 85.75,31.8 86.67,30.89 86.67,30.28 87.73,29.21 89.56,29.21 91.69,27.08 91.69,25.86 90.32,24.49 84.68,24.49 83.16,22.96 77.52,22.96 DATA_TO_ADDR1:IC1.15
A4  (via drill 0.35)
  Top 0.152: U$1.A4 16.56,2.54 16.56,4.98 U$1.A20 | v80.57,19.61 79.2,19.61 78.59,19 74.47,19 74.02,19.46 63.2,19.46 62.43,18.69 62.43,7.11 v62.74,6.81
  Bottom 0.152: v80.57,19.61 80.57,21.74 77.52,24.79 77.52,25.4 DATA_TO_ADDR1:IC1.14 | v62.74,6.81 60.3,6.81 59.38,5.89 47.19,5.89 44.6,3.3 28.45,3.3 27.53,2.39 27.53,1.93 27.38,1.78 17.32,1.78 16.56,2.54 U$1.A4
A5  (via drill 0.35)
  Top 0.152: U$1.A5 19,2.54 19,4.98 U$1.A21 | v83.62,28.91 83.46,28.91 82.55,27.99 77.52,27.99 DATA_TO_ADDR1:IC1.13 | v69.29,38.51 67.31,38.51 67,38.81 17.78,38.81 16.26,37.29 16.26,35.92 14.88,34.54 10.92,34.54 6.66,30.28 6.66,16.71 9.09,14.28 v14.58,14.28
  Bottom 0.152: v83.62,28.91 85.9,28.91 86.97,29.97 86.97,33.17 84.99,35.15 81.03,35.15 79.65,36.52 79.65,37.9 79.05,38.51 v69.29,38.51 | v14.58,14.28 14.58,12.75 16.87,10.46 16.87,7.26 U$1.A21
A6
  Top 0.152: U$1.A22 U$1.A6
  Bottom 0.152: DATA_TO_ADDR1:IC1.12 77.37,30.43 76.91,30.43 72.03,25.55 19.3,25.55 19.15,25.71 18.54,25.71 18.24,25.4 18.24,23.11 19,22.35 19,7.72 21.59,5.13 U$1.A22
A7  (via drill 0.35)
  Top 0.152: U$1.A7 24.18,2.54 24.18,4.98 U$1.A23 24.03,5.13 21.89,7.26 v10.16,7.26 | v15.8,34.54 v19,34.54
  Bottom 0.152: DATA_TO_ADDR1:IC1.11 66.85,33.02 66.09,33.78 19.76,33.78 v19,34.54 | v15.8,34.54 13.51,34.54 9.25,30.28 9.25,13.97 9.86,13.36 9.86,11.84 9.25,11.23 9.25,8.18 v10.16,7.26
A8  (via drill 0.35)
  Top 0.152: U$1.A8 26.62,2.54 26.62,4.98 U$1.A24 | v73.41,12.45 74.62,13.67 80.87,13.67 81.18,13.97 86.21,13.97 87.43,15.19 88.8,15.19 DATA_TO_ADDR1:IC2.18 | v60.91,12.14 60,11.23 60,7.42 v59.69,7.11
  Bottom 0.152: v73.41,12.45 70.21,12.45 69.9,12.75 61.52,12.75 v60.91,12.14 | v59.69,7.11 47.95,7.11 44.45,3.61 27.84,3.61 26.77,2.54 U$1.A8
A9  (via drill 0.35)
  Top 0.152: U$1.A9 U$1.A25 29.21,5.13 31.5,7.42 31.5,29.67 36.22,34.39 v65.63,34.39
  Bottom 0.152: v65.63,34.39 67,35.76 67,37.29 68.83,39.12 83.46,39.12 84.84,37.74 84.84,36.37 86.06,35.15 88.8,35.15 90.47,33.48 90.47,24.94 90.02,24.49 88.49,24.49 87.27,23.27 87.27,19.91 88.8,18.39 88.8,17.78 DATA_TO_ADDR1:IC2.17
A10  (via drill 0.35)
  Top 0.152: U$1.A10 31.8,2.54 31.8,4.98 U$1.A26 | v80.72,6.81 v83.16,9.25 | v76,2.08 v76.91,3
  Bottom 0.152: v83.16,9.25 86.21,9.25 86.97,10.01 86.97,12.75 87.88,13.67 89.26,13.67 90.47,14.88 90.47,18.24 88.95,19.76 88.95,20.22 DATA_TO_ADDR1:IC2.16 | v76.91,3 v80.72,6.81 | v76,2.08 75.39,1.47 32.87,1.47 31.8,2.54 U$1.A10
A11  (via drill 0.35)
  Top 0.152: U$1.A11 34.24,2.54 34.24,4.98 U$1.A27 | v91.24,20.52 DATA_TO_ADDR1:IC2.15
  Bottom 0.152: v91.24,20.52 91.24,13.06 89.26,11.07 87.88,11.07 87.27,10.46 87.27,9.86 86.06,8.64 77.37,8.64 76.76,9.25 76.45,9.25 75.54,10.16 75.54,12.6 74.17,13.97 55.12,13.97 51.77,10.62 51.77,9.09 50.7,8.03 37.29,8.03 34.39,5.13 U$1.A27
A12
  Top 0.152: U$1.A12 U$1.A28 36.83,5.13 34.24,7.72 34.24,10.92 31.8,13.36 31.8,14.43 33.93,16.56 33.93,29.52 37.59,33.17 71.73,33.17 75.39,29.52 85.45,29.52 86.67,28.3 86.67,28.14 88.8,26.01 88.8,25.4 DATA_TO_ADDR1:IC2.14
A13  (via drill 0.35)
  Top 0.152: U$1.A13 39.42,2.54 39.42,4.98 U$1.A29 | v91.08,26.16 89.41,27.84 88.95,27.84 DATA_TO_ADDR1:IC2.13 | v88.19,21.59 87.27,20.68 87.27,17.93 85.6,16.26 v80.26,16.26 | v70.51,15.49 67.31,12.29 v67.31,12.14 | v64.72,12.14 64.72,11.68 64.41,11.38 64.41,9.09 v63.04,7.72
  Bottom 0.152: v91.08,26.16 91.08,23.11 89.56,21.59 v88.19,21.59 | v80.26,16.26 79.81,16.26 79.65,16.1 78.59,16.1 78.44,16.26 74.17,16.26 73.41,15.49 v70.51,15.49 | v64.72,12.14 v67.31,12.14 | v63.04,7.72 42.01,7.72 U$1.A29
A14  (via drill 0.35)
  Top 0.152: U$1.A14 41.86,2.54 41.86,4.98 U$1.A30 | v97.18,24.18 95.81,24.18 89.56,30.43 88.95,30.43 DATA_TO_ADDR1:IC2.12
  Bottom 0.152: v97.18,24.18 98.7,22.66 98.7,9.09 92.91,3.3 86.97,3.3 85.9,2.23 85.9,1.93 85.75,1.78 77.22,1.78 75.08,3.91 47.35,3.91 45.21,1.78 42.77,1.78 42.01,2.54 U$1.A14
A15  (via drill 0.35)
  Top 0.152: U$1.A15 U$1.A31 44.45,5.13 43.69,5.89 37.9,5.89 34.54,9.25 34.54,11.07 v36.22,12.75
  Bottom 0.152: v36.22,12.75 43.99,12.75 45.52,14.28 77.83,14.28 80.42,11.68 86.06,11.68 86.67,12.29 86.67,12.9 86.97,13.21 86.97,23.42 87.27,23.72 87.27,30.89 88.8,32.41 88.8,33.02 DATA_TO_ADDR1:IC2.11
CLOCK  (via drill 0.35)
  Top 0.152: U$1.CLK1 85.14,4.98 85.14,2.54 U$1.CLK 84.53,2.54 83.16,1.17 59.54,1.17 58.78,1.93 58.78,8.48 59.38,9.09 59.38,11.23 58.78,11.84 58.17,11.84 57.4,11.07 57.4,6.35 58.01,5.74 58.01,1.93 57.86,1.78 51.92,1.78 43.54,10.16 DATA_TO_ADDR1:LO_ADDR:IC1.7 43.08,10.16 43.08,15.49 v42.16,16.41
  Bottom 0.152: 20.52,21.44 20.37,21.59 DATA_TO_ADDR1:HI_ADDR:IC2.7 20.52,21.44 | 20.52,21.44 21.28,20.68 21.28,16.71 20.37,15.8 20.37,10.16 DATA_TO_ADDR1:LO_ADDR:IC2.7 | 42.16,19.46 42.16,20.68 43.08,21.59 DATA_TO_ADDR1:HI_ADDR:IC1.7 | 42.16,19.46 v42.16,16.41 | 20.52,21.44 22.35,23.27 24.33,23.27 28.14,19.46 42.16,19.46
DATA_0  (via drill 0.35)
  Top 0.152: DATA_TO_ADDR1:HI_ADDR:IC1.11 41.25,29.21 43.23,27.23 51.16,27.23 | 51.16,27.23 53.9,27.23 DATA_TO_ADDR1:HI_ADDR:IC3.18 | U$1.D0 57.1,2.54 57.1,4.98 U$1.D8 57.1,5.13 57.1,16.56 DATA_TO_ADDR1:LO_ADDR:IC3.18 53.9,19.76 v52.22,19.76 52.22,22.2 51.16,23.27 51.16,27.23
  Bottom 0.152: DATA_TO_ADDR1:LO_ADDR:IC1.11 40.64,17.02 41.86,15.8 45.97,15.8 49.94,19.76 v52.22,19.76
DATA_1
  Top 0.152: 38.2,29.21 39.12,28.3 39.12,20.68 38.2,19.76 38.2,17.78 DATA_TO_ADDR1:LO_ADDR:IC1.12 | U$1.D1 U$1.D9 59.69,6.2 59.08,6.81 59.08,8.33 59.69,8.94 59.69,16.56 58.47,17.78 DATA_TO_ADDR1:LO_ADDR:IC3.17 58.32,17.78 58.32,19.3 57.1,20.52 57.1,27.99 58.32,29.21 | 38.2,29.21 38.2,29.67 40.03,31.5 56.03,31.5 58.32,29.21 | 38.2,29.21 DATA_TO_ADDR1:HI_ADDR:IC1.12 | 58.32,29.21 DATA_TO_ADDR1:HI_ADDR:IC3.17
DATA_2
  Top 0.152: DATA_TO_ADDR1:LO_ADDR:IC1.13 35.46,17.78 35.46,19.76 34.54,20.68 34.54,28.3 35.46,29.21 DATA_TO_ADDR1:HI_ADDR:IC1.13 36.07,29.21 38.66,31.8 58.32,31.8 60.91,29.21 | U$1.D2 62.28,2.54 62.28,4.98 U$1.D10 62.13,5.13 62.13,11.84 61.06,12.9 61.06,17.78 DATA_TO_ADDR1:LO_ADDR:IC3.16 60.91,17.78 59.23,19.46 58.62,19.46 57.4,20.68 57.4,22.5 60.91,26.01 60.91,29.21 | 60.91,29.21 DATA_TO_ADDR1:HI_ADDR:IC3.16
DATA_3  (via drill 0.35)
  Top 0.152: U$1.D3 64.72,2.54 64.72,4.98 U$1.D11 64.72,5.13 64.72,11.23 65.33,11.84 65.33,12.45 63.5,14.28 63.5,15.49 | 63.5,15.49 DATA_TO_ADDR1:LO_ADDR:IC3.15 | DATA_TO_ADDR1:LO_ADDR:IC1.14 33.02,19.61 32.11,20.52 32.11,28.3 DATA_TO_ADDR1:HI_ADDR:IC1.14 | v63.04,15.49 63.5,15.49
  Bottom 0.152: DATA_TO_ADDR1:HI_ADDR:IC3.15 62.89,29.21 60.6,31.5 35.31,31.5 DATA_TO_ADDR1:HI_ADDR:IC1.14 | v63.04,15.49 53.59,15.49 51.77,17.32 51.77,18.85 51.16,19.46 50.09,19.46 46.13,15.49 35.31,15.49 DATA_TO_ADDR1:LO_ADDR:IC1.14
DATA_4  (via drill 0.35)
  Top 0.152: U$1.D12 U$1.D4 | 67.16,5.28 67.31,5.13 U$1.D12 | 67.16,5.28 65.02,7.42 65.02,11.07 65.94,11.99 65.94,17.78 DATA_TO_ADDR1:LO_ADDR:IC3.14 | 67.16,5.28 69.6,7.72 69.6,11.23 74.93,16.56 78.28,16.56 79.05,17.32 80.57,17.32 82.25,19 85.75,19 86.67,19.91 86.67,20.68 86.06,21.29 76.61,21.29 75.54,22.35 75.54,22.66 72.95,25.25 69.14,25.25 v68.22,26.16 66.09,28.3 66.09,29.21 DATA_TO_ADDR1:HI_ADDR:IC3.14 | 67.16,5.28 U$1.D12
  Bottom 0.152: DATA_TO_ADDR1:LO_ADDR:IC2.11 17.78,19.61 16.87,20.52 16.87,26.16 | 16.87,26.16 16.87,28.3 DATA_TO_ADDR1:HI_ADDR:IC2.11 | v68.22,26.16 16.87,26.16
DATA_5  (via drill 0.35)
  Top 0.152: U$1.D5 69.9,2.54 69.9,4.98 U$1.D13 | 68.53,15.19 68.53,14.28 66.7,12.45 66.7,11.53 67.46,10.77 v67.46,6.65 | 68.53,15.19 68.53,17.78 DATA_TO_ADDR1:LO_ADDR:IC3.13 | DATA_TO_ADDR1:LO_ADDR:IC2.12 14.73,17.78 13.06,16.1 9.86,16.1 8.94,17.02 8.94,29.97 9.86,30.89 13.51,30.89 15.19,29.21 DATA_TO_ADDR1:HI_ADDR:IC2.12 | v66.55,15.19 68.53,15.19
  Bottom 0.152: v67.46,6.65 67.92,6.65 69.44,5.13 69.75,5.13 U$1.D13 | DATA_TO_ADDR1:HI_ADDR:IC3.13 68.07,29.21 64.11,33.17 19.3,33.17 15.34,29.21 DATA_TO_ADDR1:HI_ADDR:IC2.12 | v66.55,15.19 63.65,15.19 63.35,14.88 45.21,14.88 43.99,13.67 34.09,13.67 31.5,11.07 31.5,9.25 28.14,5.89 23.42,5.89 22.35,4.83 22.35,4.37 22.2,4.22 20.98,4.22 19.91,5.28 19.91,6.35 18.69,7.57 18.69,14.43 15.34,17.78 DATA_TO_ADDR1:LO_ADDR:IC2.12
DATA_6  (via drill 0.35)
  Top 0.152: U$1.D6 72.34,2.54 72.34,4.98 U$1.D14 | 71.12,16.1 71.12,13.67 v69.6,12.14 | 71.12,16.1 DATA_TO_ADDR1:LO_ADDR:IC3.12 | v18.85,27.84 18.39,27.84 18.09,27.53 14.43,27.53 12.75,29.21 DATA_TO_ADDR1:HI_ADDR:IC2.13 | 71.12,16.1 74.02,16.1 75.84,17.93 75.84,18.09 76.45,18.69 80.57,18.69 v81.48,19.61 | v81.48,24.18 81.48,25.09 v82.4,26.01 | v74.62,27.23 73.1,27.23 DATA_TO_ADDR1:HI_ADDR:IC3.12
  Bottom 0.152: v69.6,12.14 71.12,12.14 72.64,10.62 72.64,9.25 75.08,6.81 76.45,6.81 76.76,6.5 76.76,5.89 76.45,5.59 75.84,5.59 75.54,5.89 73.25,5.89 72.49,5.13 U$1.D14 | DATA_TO_ADDR1:LO_ADDR:IC2.13 12.6,17.78 12.6,19.76 11.68,20.68 11.68,28.3 12.6,29.21 DATA_TO_ADDR1:HI_ADDR:IC2.13 | DATA_TO_ADDR1:HI_ADDR:IC3.12 70.51,29.21 68.07,26.77 23.57,26.77 23.42,26.62 20.07,26.62 v18.85,27.84 | v81.48,24.18 v81.48,19.61 | v82.4,26.01 81.48,26.01 80.57,26.92 74.93,26.92 v74.62,27.23
DATA_7  (via drill 0.35)
  Top 0.152: DATA_TO_ADDR1:LO_ADDR:IC2.14 10.16,19.61 9.25,20.52 9.25,27.23 | 9.25,27.23 9.25,28.3 DATA_TO_ADDR1:HI_ADDR:IC2.14 | U$1.D7 U$1.D15 74.93,5.13 74.17,5.13 70.21,9.09 70.21,11.38 75.08,16.26 78.44,16.26 78.89,16.71 v79.35,16.71 79.5,16.87 80.57,16.87 82.4,18.69 85.9,18.69 86.97,19.76 86.97,20.83 86.21,21.59 76.76,21.59 75.84,22.5 75.84,23.27 76.45,23.88 78.74,23.88 80.26,25.4 80.26,26.01 79.35,26.92 76.45,26.92 74.17,29.21 DATA_TO_ADDR1:HI_ADDR:IC3.11 73.56,29.21 73.56,30.43 71.12,32.87 66.85,32.87 64.87,30.89 v60.15,30.89 | v23.11,27.23 9.25,27.23
  Bottom 0.152: DATA_TO_ADDR1:LO_ADDR:IC3.11 75.54,17.78 76.61,16.71 v79.35,16.71 | v23.11,27.23 46.89,27.23 50.55,30.89 v60.15,30.89
DATA_TO_ADDR1:HI_ADDR:CLR
  Top 0.152: DATA_TO_ADDR1:HI_ADDR:IC2.15 7.72,29.21 11.53,33.02 27.38,33.02 30.43,29.97 30.43,29.21 DATA_TO_ADDR1:HI_ADDR:IC1.15
DATA_TO_ADDR1:LO_ADDR:CLR
  Top 0.152: DATA_TO_ADDR1:LO_ADDR:IC2.15 7.72,17.78 9.7,15.8 28.45,15.8 30.43,17.78 DATA_TO_ADDR1:LO_ADDR:IC1.15
DATA_TO_ADDR1:N$16
  Top 0.152: DATA_TO_ADDR1:HI_ADDR:IC1.6 40.64,27.23 39.73,28.14 39.73,30.28 40.34,30.89 46.74,30.89 50.09,27.53 53.59,27.53 54.97,28.91 54.97,30.28 55.58,30.89 56.19,30.89 56.79,30.28 56.79,24.94 53.44,21.59 DATA_TO_ADDR1:HI_ADDR:IC3.2
  Bottom 0.152: DATA_TO_ADDR1:IC1.2 84.99,12.75 84.68,12.75 78.13,19.3 74.17,19.3 73.86,19.61 55.42,19.61 53.44,21.59 DATA_TO_ADDR1:HI_ADDR:IC3.2
DATA_TO_ADDR1:N$17  (via drill 0.35)
  Top 0.152: v74.93,15.19 75.84,14.28 78.44,14.28 79.35,15.19 84.99,15.19 DATA_TO_ADDR1:IC1.3
  Bottom 0.152: DATA_TO_ADDR1:HI_ADDR:IC1.5 38.66,21.59 41.25,24.18 52.38,24.18 | 52.38,24.18 53.29,24.18 DATA_TO_ADDR1:HI_ADDR:IC3.3 | v74.93,15.19 71.12,15.19 70.81,14.88 67.77,14.88 66.55,16.1 55.58,16.1 54.36,17.32 54.36,18.69 53.14,19.91 52.98,19.91 52.38,20.52 52.38,24.18
DATA_TO_ADDR1:N$18  (via drill 0.35)
  Top 0.152: v72.64,24.64 v74.93,22.35 | v63.8,24.64 61.52,24.64 58.47,21.59 DATA_TO_ADDR1:HI_ADDR:IC3.4 | v51.77,23.57 54.51,23.57 v54.66,23.72
  Bottom 0.152: DATA_TO_ADDR1:IC1.4 81.48,17.78 79.05,20.22 79.05,20.68 77.83,21.89 75.39,21.89 v74.93,22.35 | v63.8,24.64 v72.64,24.64 | DATA_TO_ADDR1:HI_ADDR:IC1.4 36.07,21.59 37.74,19.91 40.95,19.91 42.16,21.13 42.16,22.5 43.23,23.57 v51.77,23.57 | v54.66,23.72 56.19,23.72 58.32,21.59 DATA_TO_ADDR1:HI_ADDR:IC3.4
DATA_TO_ADDR1:N$19
  Top 0.152: DATA_TO_ADDR1:IC1.5 84.99,20.22 79.35,20.22 78.44,19.3 74.62,19.3 74.02,19.91 62.74,19.91 61.06,21.59 DATA_TO_ADDR1:HI_ADDR:IC3.5
  Bottom 0.152: DATA_TO_ADDR1:HI_ADDR:IC1.3 36.22,24.79 57.71,24.79 60.91,21.59 DATA_TO_ADDR1:HI_ADDR:IC3.5
DATA_TO_ADDR1:N$20  (via drill 0.35)
  Top 0.152: DATA_TO_ADDR1:HI_ADDR:IC2.6 18.39,21.59 v28.14,31.34 | v64.41,27.38 64.41,22.5 DATA_TO_ADDR1:HI_ADDR:IC3.6 | v79.65,25.71 79.2,25.71 78.28,26.62 68.68,26.62 v67.77,27.53
  Bottom 0.152: v28.14,31.34 34.7,31.34 35.15,31.8 62.89,31.8 64.41,30.28 64.41,27.53 | v79.65,25.71 80.87,25.71 83.62,22.96 84.99,22.96 DATA_TO_ADDR1:IC1.6 | 64.41,27.53 v67.77,27.53 | 64.41,27.53 v64.41,27.38
DATA_TO_ADDR1:N$21  (via drill 0.35)
  Top 0.152: v18.85,25.09 15.34,21.59 DATA_TO_ADDR1:HI_ADDR:IC2.5
  Bottom 0.152: v18.85,25.09 62.43,25.09 65.94,21.59 DATA_TO_ADDR1:HI_ADDR:IC3.7 66.09,21.59 67.77,23.27 72.19,23.27 75.54,26.62 80.42,26.62 81.64,25.4 DATA_TO_ADDR1:IC1.7
DATA_TO_ADDR1:N$22  (via drill 0.35)
  Top 0.152: DATA_TO_ADDR1:HI_ADDR:IC3.8 68.53,21.59 68.53,24.18 64.72,27.99 64.72,30.28 66.7,32.26 v67.16,32.26 69.9,32.26 70.05,32.11 v70.97,32.11
  Bottom 0.152: v67.16,32.26 65.94,33.48 17.47,33.48 14.28,30.28 14.28,28.75 12.75,27.23 12.75,21.59 DATA_TO_ADDR1:HI_ADDR:IC2.4 | v70.97,32.11 71.27,31.8 78.59,31.8 79.35,31.04 79.35,30.58 82.86,27.08 83.46,27.08 84.23,27.84 84.99,27.84 DATA_TO_ADDR1:IC1.8
DATA_TO_ADDR1:N$23  (via drill 0.35)
  Top 0.152: v15.04,33.93 35.31,33.93 36.22,34.85 65.18,34.85 65.33,35 78.13,35 82.55,30.58 84.99,30.58 DATA_TO_ADDR1:IC1.9 | DATA_TO_ADDR1:HI_ADDR:IC3.9 71.12,22.2 65.02,28.3 65.02,30.12 66.55,31.65 v69.6,31.65
  Bottom 0.152: DATA_TO_ADDR1:HI_ADDR:IC2.3 10.16,27.23 11.07,28.14 11.07,29.97 v15.04,33.93 | v69.6,31.65 70.66,32.71 75.84,32.71 76.45,32.11 83.46,32.11 DATA_TO_ADDR1:IC1.9
DATA_TO_ADDR1:N$24  (via drill 0.35)
  Top 0.152: v51.61,11.84 53.29,10.16 DATA_TO_ADDR1:LO_ADDR:IC3.2
  Bottom 0.152: DATA_TO_ADDR1:LO_ADDR:IC1.6 41.25,10.16 42.93,11.84 v51.61,11.84 | DATA_TO_ADDR1:IC2.2 96.42,12.6 93.83,12.6 89.26,8.03 77.37,8.03 77.06,7.72 76.45,7.72 75.23,8.94 75.23,12.45 74.02,13.67 56.95,13.67 53.44,10.16 DATA_TO_ADDR1:LO_ADDR:IC3.2
DATA_TO_ADDR1:N$25  (via drill 0.35)
  Top 0.152: v52.68,12.45 53.59,12.45 DATA_TO_ADDR1:LO_ADDR:IC3.3
  Bottom 0.152: DATA_TO_ADDR1:LO_ADDR:IC1.5 38.66,10.16 40.95,12.45 v52.68,12.45 | DATA_TO_ADDR1:LO_ADDR:IC3.3 59.08,13.36 73.86,13.36 74.93,12.29 74.93,8.79 76.3,7.42 77.22,7.42 77.52,7.72 89.41,7.72 92.76,11.07 96.88,11.07 98.09,12.29 98.09,13.06 96.57,14.58 96.57,15.19 DATA_TO_ADDR1:IC2.3
DATA_TO_ADDR1:N$26  (via drill 0.35)
  Top 0.152: DATA_TO_ADDR1:LO_ADDR:IC1.4 36.07,10.16 40.03,6.2 47.04,6.2 51.77,1.47 58.01,1.47 58.32,1.78 58.32,10.16 DATA_TO_ADDR1:LO_ADDR:IC3.4 | DATA_TO_ADDR1:IC2.4 94.44,17.78 90.78,14.12 90.78,12.14 89.71,11.07 82.4,11.07 v77.37,6.04
  Bottom 0.152: v77.37,6.04 75.54,4.22 66.7,4.22 65.63,5.28 65.63,6.04 63.2,8.48 60.15,8.48 58.47,10.16 DATA_TO_ADDR1:LO_ADDR:IC3.4
DATA_TO_ADDR1:N$27  (via drill 0.35)
  Top 0.152: v49.94,8.64 50.39,8.64 50.55,8.48 v55.12,8.48 | DATA_TO_ADDR1:IC2.5 90.47,14.28 90.47,12.29 89.87,11.68 74.62,11.68 v74.32,11.99
  Bottom 0.152: DATA_TO_ADDR1:LO_ADDR:IC1.3 33.63,10.16 35.31,8.48 49.78,8.48 v49.94,8.64 | v55.12,8.48 56.19,8.48 57.4,9.7 57.4,11.07 58.17,11.84 59.23,11.84 59.38,11.68 | 59.38,11.68 60.91,10.16 DATA_TO_ADDR1:LO_ADDR:IC3.5 | v74.32,11.99 74.32,12.45 73.71,13.06 60.76,13.06 59.38,11.68
DATA_TO_ADDR1:N$28  (via drill 0.35)
  Top 0.152: v17.78,14.28 22.35,14.28 26.92,9.7 26.92,6.35 28.45,4.83 28.45,1.78 49.94,1.78 v50.24,2.08 | v68.38,5.28 v68.38,3.3 | v94.74,17.17 94.74,13.36 87.58,6.2 78.44,6.2 77.67,5.44 76.91,5.44 v76.15,6.2
  Bottom 0.152: v17.78,14.28 DATA_TO_ADDR1:LO_ADDR:IC2.6 | v50.24,2.08 55.27,2.08 56.49,3.3 v68.38,3.3 | v68.38,5.28 68.07,5.59 68.07,5.74 67.77,6.04 67.16,6.04 66.55,6.65 | 66.55,6.65 63.5,9.7 DATA_TO_ADDR1:LO_ADDR:IC3.6 | v94.74,17.17 94.74,20.52 96.42,22.2 96.42,22.81 DATA_TO_ADDR1:IC2.6 | v76.15,6.2 68.83,6.2 67.77,7.26 67.16,7.26 66.55,6.65
DATA_TO_ADDR1:N$29  (via drill 0.35)
  Top 0.152: v69.6,6.81 71.58,4.83 71.58,1.93 72.03,1.47 82.55,1.47 v83.92,2.85
  Bottom 0.152: DATA_TO_ADDR1:LO_ADDR:IC2.5 15.19,10.16 15.19,7.72 12.29,4.83 12.29,4.52 11.99,4.22 8.33,4.22 7.11,5.44 7.11,6.2 3.45,9.86 3.45,45.21 4.98,46.74 88.65,46.74 90.47,44.91 90.47,42.01 98.7,33.78 98.7,27.53 96.57,25.4 DATA_TO_ADDR1:IC2.7 96.42,25.4 94.89,23.88 94.89,22.05 94.13,21.29 94.13,16.87 94.44,16.56 97.18,16.56 98.4,15.34 98.4,9.25 93.37,4.22 85.29,4.22 v83.92,2.85 | v69.6,6.81 69.44,6.81 66.09,10.16 DATA_TO_ADDR1:LO_ADDR:IC3.7
DATA_TO_ADDR1:N$30  (via drill 0.35)
  Top 0.152: DATA_TO_ADDR1:LO_ADDR:IC2.4 12.14,10.16 v9.25,13.06 | v73.41,7.57 76,7.57 v76.76,8.33
  Bottom 0.152: v9.25,13.06 9.25,13.51 6.05,16.71 6.05,18.85 4.98,19.91 4.83,19.91 3.76,20.98 3.76,45.06 5.13,46.43 86.36,46.43 87.88,44.91 87.88,43.54 96.88,34.54 97.48,34.54 98.4,33.63 98.4,29.82 DATA_TO_ADDR1:IC2.8 94.59,26.01 94.59,22.2 93.83,21.44 93.83,13.06 89.1,8.33 v76.76,8.33 | DATA_TO_ADDR1:LO_ADDR:IC3.8 69.14,10.16 71.73,7.57 v73.41,7.57
DATA_TO_ADDR1:N$31  (via drill 0.35)
  Top 0.152: DATA_TO_ADDR1:LO_ADDR:IC3.9 71.12,11.07 74.02,13.97 80.72,13.97 81.03,14.28 86.06,14.28 87.27,15.49 87.27,15.65 88.49,16.87 90.02,16.87 v93.22,20.07
  Bottom 0.152: DATA_TO_ADDR1:LO_ADDR:IC2.3 10.16,15.8 11.38,17.02 11.38,29.82 13.36,31.8 15.34,31.8 18.69,35.15 24.33,35.15 28.91,39.73 88.04,39.73 90.47,37.29 90.47,35.76 95.66,30.58 | 95.66,30.58 96.42,30.58 DATA_TO_ADDR1:IC2.9 95.66,30.58 | v93.22,20.07 93.22,28.14 95.66,30.58
GND  (via drill 0.35)
  Top 0.152: MEMORY_ADDRESS_REGISTOR1:IC4.8 MEMORY_ADDRESS_REGISTOR1:IC3.1 MEMORY_ADDRESS_REGISTOR1:IC3.2 31.04,36.83 32.72,35.15 43.99,35.15 45.67,36.83 MEMORY_ADDRESS_REGISTOR1:IC3.8 MEMORY_ADDRESS_REGISTOR1:IC2.1 MEMORY_ADDRESS_REGISTOR1:IC2.2 53.9,36.83 55.58,38.51 66.85,38.51 68.53,36.83 MEMORY_ADDRESS_REGISTOR1:IC2.8 MEMORY_ADDRESS_REGISTOR1:IC1.1 MEMORY_ADDRESS_REGISTOR1:IC1.2 | DATA_TO_ADDR1:LO_ADDR:IC3.10 73.56,10.16 73.56,8.64 72.8,7.87 72.8,7.26 74.17,5.89 75.54,5.89 76.3,5.13 83.62,5.13 84.38,5.89 85.75,5.89 86.82,4.83 86.82,1.93 86.97,1.78 91.85,1.78 92.61,2.54 U$1.GND 92.76,2.54 92.76,4.98 U$1.GND1 92.76,5.13 93.52,5.13 98.7,10.31 98.7,30.89 96.57,33.02 DATA_TO_ADDR1:IC2.10 | 86.36,49.48 84.84,47.95 78.28,47.95 76.76,49.48 76.3,49.48 RAM1:IC1.10 | v80.72,24.94 80.72,25.25 v83.16,27.69 | DATA_TO_ADDR1:IC1.10 85.14,33.02 86.06,33.93 88.04,33.93 90.93,36.83 MEMORY_ADDRESS_REGISTOR1:IC1.8 91.54,36.83 91.54,42.16 94.89,45.52 95.96,45.52 97.03,46.58 97.03,47.5 96.42,48.11 89.26,48.11 87.88,49.48 86.36,49.48 | 86.36,49.48 RAM1:IC1.14 | RAM1:R2.1 55.88,72.49 58.32,72.49 RAM1:R1.1 58.47,72.34 63.5,77.37 RAM1:IC4.10 | RAM1:IC3.7 72.49,96.42 76.91,96.42 77.83,95.5 85.45,95.5 86.36,96.42 RAM1:IC2.7 | ROM1:IC2.7 43.08,96.57 42.16,97.48 34.54,97.48 33.63,96.57 29.21,96.57 ROM1:IC3.7 29.21,96.42 27.53,94.74 27.53,85.29 20.37,78.13 20.37,77.52 ROM1:IC4.10 ROM1:R1.1 15.19,72.49 12.75,72.49 ROM1:R2.1 12.6,72.34 12.6,66.7 11.07,65.18 11.07,50.55 10.16,49.63 ROM1:U$1.1 10.16,46.43 8.64,44.91 8.64,37.74 7.72,36.83 MEMORY_ADDRESS_REGISTOR1:IC4.2 MEMORY_ADDRESS_REGISTOR1:IC4.1
  Top 0.152: 45.82,14.28 45.82,15.95 46.74,16.87 46.74,20.68 45.82,21.59 DATA_TO_ADDR1:HI_ADDR:IC1.8 | 45.82,14.28 45.82,10.16 DATA_TO_ADDR1:LO_ADDR:IC1.8 | DATA_TO_ADDR1:LO_ADDR:IC1.1 DATA_TO_ADDR1:LO_ADDR:IC1.2 | DATA_TO_ADDR1:HI_ADDR:IC2.8 24.18,21.59 25.7,20.07 26.31,20.07 27.84,21.59 DATA_TO_ADDR1:HI_ADDR:IC1.1 DATA_TO_ADDR1:HI_ADDR:IC1.2 | v43.69,14.28 45.82,14.28 | 6.05,10.16 DATA_TO_ADDR1:LO_ADDR:IC2.2 7.72,10.16 9.4,8.48 13.06,8.48 13.67,9.09 13.67,10.62 14.88,11.84 20.68,11.84 22.35,10.16 DATA_TO_ADDR1:LO_ADDR:IC2.8 | 6.05,10.16 DATA_TO_ADDR1:LO_ADDR:IC2.1 | 6.05,10.16 6.05,20.68 5.13,21.59 DATA_TO_ADDR1:HI_ADDR:IC2.1
  Bottom 0.152: MEMORY_ADDRESS_REGISTOR1:IC1.8 92.61,36.83 96.42,33.02 DATA_TO_ADDR1:IC2.10 | v80.72,24.94 79.5,24.94 79.05,25.4 79.05,25.86 78.59,26.31 76.45,26.31 73.71,23.57 73.71,21.59 DATA_TO_ADDR1:HI_ADDR:IC3.10 | v83.16,27.69 83.16,28.45 83.01,28.6 83.01,29.21 83.31,29.52 86.06,29.52 86.67,30.12 86.67,31.5 85.14,33.02 DATA_TO_ADDR1:IC1.10 80.57,33.02 76.76,36.83 MEMORY_ADDRESS_REGISTOR1:IC1.2 | RAM1:IC4.10 63.5,80.57 63.2,80.87 63.2,86.82 | 63.2,86.82 64.26,87.88 65.79,87.88 70.81,92.91 70.81,94.89 72.34,96.42 RAM1:IC3.7 | DATA_TO_ADDR1:LO_ADDR:IC1.1 23.88,10.16 | 23.88,10.16 DATA_TO_ADDR1:LO_ADDR:IC2.8 | 23.88,10.16 23.88,20.68 22.96,21.59 DATA_TO_ADDR1:HI_ADDR:IC2.8 | v43.69,14.28 34.24,14.28 30.58,10.62 30.58,10.16 DATA_TO_ADDR1:LO_ADDR:IC1.2 | DATA_TO_ADDR1:HI_ADDR:IC2.2 6.66,21.59 | 6.66,21.59 DATA_TO_ADDR1:HI_ADDR:IC2.1 | 6.66,21.59 6.66,35.92 7.57,36.83 MEMORY_ADDRESS_REGISTOR1:IC4.2 | 63.2,86.82 52.83,86.82 43.23,96.42 ROM1:IC2.7 | RAM1:R1.1 61.98,68.83 61.98,64.26 76.15,50.09 76.15,49.63 RAM1:IC1.10
  pour Top: 0,0 99.95,0 99.95,99.95 0,99.95
  pour Bottom: 0,0 99.95,0 99.95,99.95 0,99.95
MEMORY_ADDRESS_REGISTOR1:CLOCK
  Top 0.152: MEMORY_ADDRESS_REGISTOR1:IC4.7 20.83,36.83 22.5,38.51 41.4,38.51 43.08,36.83 MEMORY_ADDRESS_REGISTOR1:IC3.7
  Bottom 0.152: MEMORY_ADDRESS_REGISTOR1:IC3.7 43.23,36.83 44.91,38.51 63.8,38.51 65.48,36.83 MEMORY_ADDRESS_REGISTOR1:IC2.7 66.09,36.83 68.68,39.42 85.75,39.42 88.34,36.83 MEMORY_ADDRESS_REGISTOR1:IC1.7
RAM1:N$1
  Bottom 0.152: RAM1:IC1.11 78.74,62.74 77.83,63.65 77.83,78.59 78.28,79.05 82.25,79.05 RAM1:IC4.2
RAM1:N$2
  Bottom 0.152: RAM1:IC1.12 81.33,49.63 81.33,62.89 82.25,63.8 82.25,76.45 81.33,77.37 RAM1:IC4.3
RAM1:N$3
  Bottom 0.152: RAM1:IC4.4 78.74,71.88 80.26,70.36 80.26,48.56 80.87,47.95 82.25,47.95 RAM1:IC1.13
RAM1:N$4
  Top 0.152: RAM1:IC4.5 76.3,77.37 76.3,76.76 82.86,70.21 82.86,68.38 86.36,64.87 RAM1:IC1.15
RAM1:N$5
  Top 0.152: RAM1:IC4.6 73.71,77.37 73.71,76.91 80.26,70.36 80.26,68.38 83.77,64.87 RAM1:IC1.16
RAM1:N$6
  Top 0.152: RAM1:IC4.7 71.12,76.91 77.83,70.21 77.83,68.22 RAM1:IC1.17
RAM1:N$7
  Top 0.152: RAM1:IC4.8 68.68,77.37 68.68,76.76 75.23,70.21 75.23,68.38 78.74,64.87 RAM1:IC1.18
RAM1:N$8
  Top 0.152: RAM1:IC4.9 66.09,77.37 66.09,76.91 72.64,70.36 72.64,68.38 76.15,64.87 RAM1:IC1.19
RAM1:N$23
  Top 0.152: 58.47,80.26 58.47,84.99 RAM1:S1.2 | 58.47,80.26 58.47,80.11 RAM1:R1.2 58.47,80.26 | 58.47,80.26 65.79,80.26 67.77,82.25 73.1,82.25 76,85.14 79.5,85.14 85.75,91.39 86.36,91.39 RAM1:IC2.5
RAM1:N$24
  Top 0.152: RAM1:S1.1 RAM1:R2.2 55.88,79.96 56.79,79.05 78.44,79.05 83.16,83.77 86.36,83.77 RAM1:IC2.2
RAM1:N$27
  Top 0.152: RAM1:IC2.3 84.84,84.84 77.83,84.84 74.32,81.33 72.49,81.33 RAM1:IC3.1
RAM1:N$28
  Top 0.152: RAM1:IC2.6 80.26,87.88 78.28,87.88 74.32,83.92 72.49,83.92 RAM1:IC3.2
RAM1:N$29
  Bottom 0.152: RAM1:IC3.3 72.49,86.36 72.49,85.75 74.62,83.62 74.62,65.79 73.71,64.87 RAM1:IC1.20
RESET  (via drill 0.35)
  Top 0.152: U$1.RST 87.58,2.54 87.58,4.98 U$1.RST1 87.73,5.13 87.73,5.89 96.11,14.28 97.48,14.28 98.09,14.88 98.09,20.68 97.18,21.59 94.89,21.59 v93.98,22.5
  Bottom 0.152: MEMORY_ADDRESS_REGISTOR1:IC4.15 8.18,44.45 9.86,46.13 28.75,46.13 30.43,44.45 MEMORY_ADDRESS_REGISTOR1:IC3.15 31.04,44.45 32.72,46.13 51.61,46.13 53.29,44.45 MEMORY_ADDRESS_REGISTOR1:IC2.15 53.9,44.45 55.58,46.13 74.47,46.13 76.15,44.45 MEMORY_ADDRESS_REGISTOR1:IC1.15 76.3,44.45 77.98,42.77 87.43,42.77 95.96,34.24 97.33,34.24 98.09,33.48 98.09,30.12 97.48,29.52 96.11,29.52 93.98,27.38 v93.98,22.5
ROM1:N$1
  Bottom 0.152: ROM1:U$1.11 35.46,49.63 35.46,62.89 34.54,63.8 34.54,78.44 35.15,79.05 39.12,79.05 40.64,77.52 ROM1:IC4.2
ROM1:N$2
  Bottom 0.152: ROM1:IC4.3 39.12,76.45 39.12,63.8 38.2,62.89 38.2,49.63 ROM1:U$1.12
ROM1:N$3
  Bottom 0.152: ROM1:U$1.13 40.64,49.48 40.03,49.48 38.51,47.95 37.74,47.95 36.53,49.17 36.53,76.45 35.61,77.37 ROM1:IC4.4
ROM1:N$4
  Top 0.152: ROM1:U$1.15 43.08,64.87 43.08,67.92 41.55,69.44 41.55,70.97 36.68,75.84 34.54,75.84 33.02,77.37 ROM1:IC4.5
ROM1:N$5
  Top 0.152: ROM1:U$1.16 40.64,65.33 36.53,69.44 36.53,71.42 ROM1:IC4.6
ROM1:N$6
  Top 0.152: ROM1:U$1.17 38.05,64.87 38.05,65.33 33.93,69.44 33.93,71.42 27.99,77.37 ROM1:IC4.7
ROM1:N$7
  Top 0.152: ROM1:U$1.18 35.46,64.87 35.46,65.48 31.5,69.44 31.5,71.27 25.4,77.37 ROM1:IC4.8
ROM1:N$8
  Top 0.152: ROM1:U$1.19 33.02,65.33 28.91,69.44 28.91,71.42 ROM1:IC4.9
ROM1:N$23
  Top 0.152: ROM1:R1.2 15.34,80.11 15.34,84.99 ROM1:S1.2
  Bottom 0.152: ROM1:IC2.5 43.08,91.39 40.03,91.39 36.53,87.88 18.09,87.88 15.34,85.14 ROM1:S1.2
ROM1:N$24
  Top 0.152: ROM1:R2.2 12.75,80.11 12.75,84.99 ROM1:S1.1
  Bottom 0.152: ROM1:IC2.2 43.08,83.92 40.03,83.92 36.37,87.58 19.76,87.58 15.65,83.46 14.28,83.46 12.75,84.99 ROM1:S1.1
ROM1:N$27
  Top 0.152: ROM1:IC3.1 29.21,81.33 31.04,81.33 35.15,85.45 42.16,85.45 43.08,86.36 ROM1:IC2.3
ROM1:N$28
  Top 0.152: ROM1:IC3.2 29.21,83.92 31.19,83.92 35.15,87.88 36.98,87.88 43.08,93.98 ROM1:IC2.6
ROM1:N$29
  Bottom 0.152: ROM1:IC3.3 31.5,84.07 31.5,68.83 30.58,67.92 30.58,64.87 ROM1:U$1.20
VCC  (via drill 0.35)
  Top 0.152: RAM1:IC4.1 RAM1:IC4.20 | RAM1:S1.4 55.88,92.76 58.32,92.76 RAM1:S1.3 58.47,92.61 58.47,88.19 | 58.47,88.19 64.72,81.94 64.72,81.33 RAM1:IC3.14 | ROM1:S1.4 12.75,92.76 15.19,92.76 ROM1:S1.3 15.34,92.61 15.34,88.04 21.59,81.79 ROM1:IC3.14 21.59,81.18 20.22,81.18 5.13,66.09 5.13,44.45 MEMORY_ADDRESS_REGISTOR1:IC4.16 | ROM1:IC4.1 43.23,77.37 43.23,69.9 ROM1:IC4.20 43.23,69.75 48.11,64.87 53.29,64.87 RAM1:IC1.28 | ROM1:IC2.14 35.61,81.18 39.42,81.18 43.08,77.52 ROM1:IC4.1 | 58.47,88.19 53.9,88.19 ROM1:IC4.1 | DATA_TO_ADDR1:HI_ADDR:IC3.19 DATA_TO_ADDR1:HI_ADDR:IC3.20 48.87,29.21 46.89,31.19 40.18,31.19 39.42,30.43 39.42,20.83 40.34,19.91 43.54,19.91 44.75,21.13 44.75,22.66 45.36,23.27 49.02,23.27 50.7,21.59 DATA_TO_ADDR1:HI_ADDR:IC3.1 50.85,21.59 50.85,17.78 | v26.01,20.68 26.01,21.59 27.84,23.42 27.84,29.21 DATA_TO_ADDR1:HI_ADDR:IC1.16 | 50.85,17.78 50.85,10.16 DATA_TO_ADDR1:LO_ADDR:IC3.1 | 50.85,17.78 DATA_TO_ADDR1:LO_ADDR:IC3.19 | 50.85,17.78 DATA_TO_ADDR1:LO_ADDR:IC3.20 | DATA_TO_ADDR1:IC1.1 87.58,10.16 | 87.58,10.16 DATA_TO_ADDR1:IC2.20 | U$1.VCC U$1.VCC1 90.17,5.13 95.2,10.16 DATA_TO_ADDR1:IC2.1 96.57,10.16 96.57,10.77 98.4,12.6 98.4,20.83 97.33,21.89 95.5,21.89 92,25.4 92,27.23 89.71,29.52 87.88,29.52 86.97,30.43 86.97,31.04 85.9,32.11 84.07,32.11 79.65,36.52 79.65,38.51 73.71,44.45 MEMORY_ADDRESS_REGISTOR1:IC1.16 | v87.58,7.11 87.58,10.16 | 4.98,17.78 4.98,19.76 4.06,20.68 4.06,28.3 4.98,29.21 DATA_TO_ADDR1:HI_ADDR:IC2.16 | MEMORY_ADDRESS_REGISTOR1:IC2.16 49.33,44.45 47.65,42.77 29.67,42.77 27.99,44.45 MEMORY_ADDRESS_REGISTOR1:IC3.16
  Top 0.152: v24.49,10.77 24.49,9.86 23.11,8.48 13.51,8.48 13.21,8.18 5.13,8.18 4.06,9.25 4.06,16.87 4.98,17.78 | 4.98,17.78 DATA_TO_ADDR1:LO_ADDR:IC2.16
  Bottom 0.152: RAM1:IC4.1 86.36,77.52 82.7,81.18 78.74,81.18 RAM1:IC2.14 78.74,81.79 74.02,86.51 74.02,86.67 73.41,87.27 70.81,87.27 64.87,81.33 RAM1:IC3.14 | ROM1:IC3.14 21.59,81.33 22.2,81.33 28.14,87.27 30.28,87.27 33.93,83.62 33.93,82.86 35.46,81.33 ROM1:IC2.14 | 29.97,16.26 31.04,15.19 48.11,15.19 50.7,17.78 DATA_TO_ADDR1:LO_ADDR:IC3.20 | 29.97,16.26 28.45,17.78 DATA_TO_ADDR1:LO_ADDR:IC1.16 27.84,17.78 26.01,19.61 v26.01,20.68 | DATA_TO_ADDR1:IC1.1 DATA_TO_ADDR1:IC1.20 | v87.58,7.11 88.19,7.11 90.17,5.13 U$1.VCC1 | 4.98,42.77 4.98,38.66 4.06,37.74 4.06,30.12 4.98,29.21 DATA_TO_ADDR1:HI_ADDR:IC2.16 | 4.98,42.77 4.98,44.45 MEMORY_ADDRESS_REGISTOR1:IC4.16 | MEMORY_ADDRESS_REGISTOR1:IC3.16 24.79,44.45 23.11,42.77 4.98,42.77 | MEMORY_ADDRESS_REGISTOR1:IC1.16 70.51,44.45 68.83,42.77 52.53,42.77 50.85,44.45 MEMORY_ADDRESS_REGISTOR1:IC2.16 | v24.49,10.77 29.97,16.26